# EAGLE design masterboard_b13 (EAGLE 8.2.1)
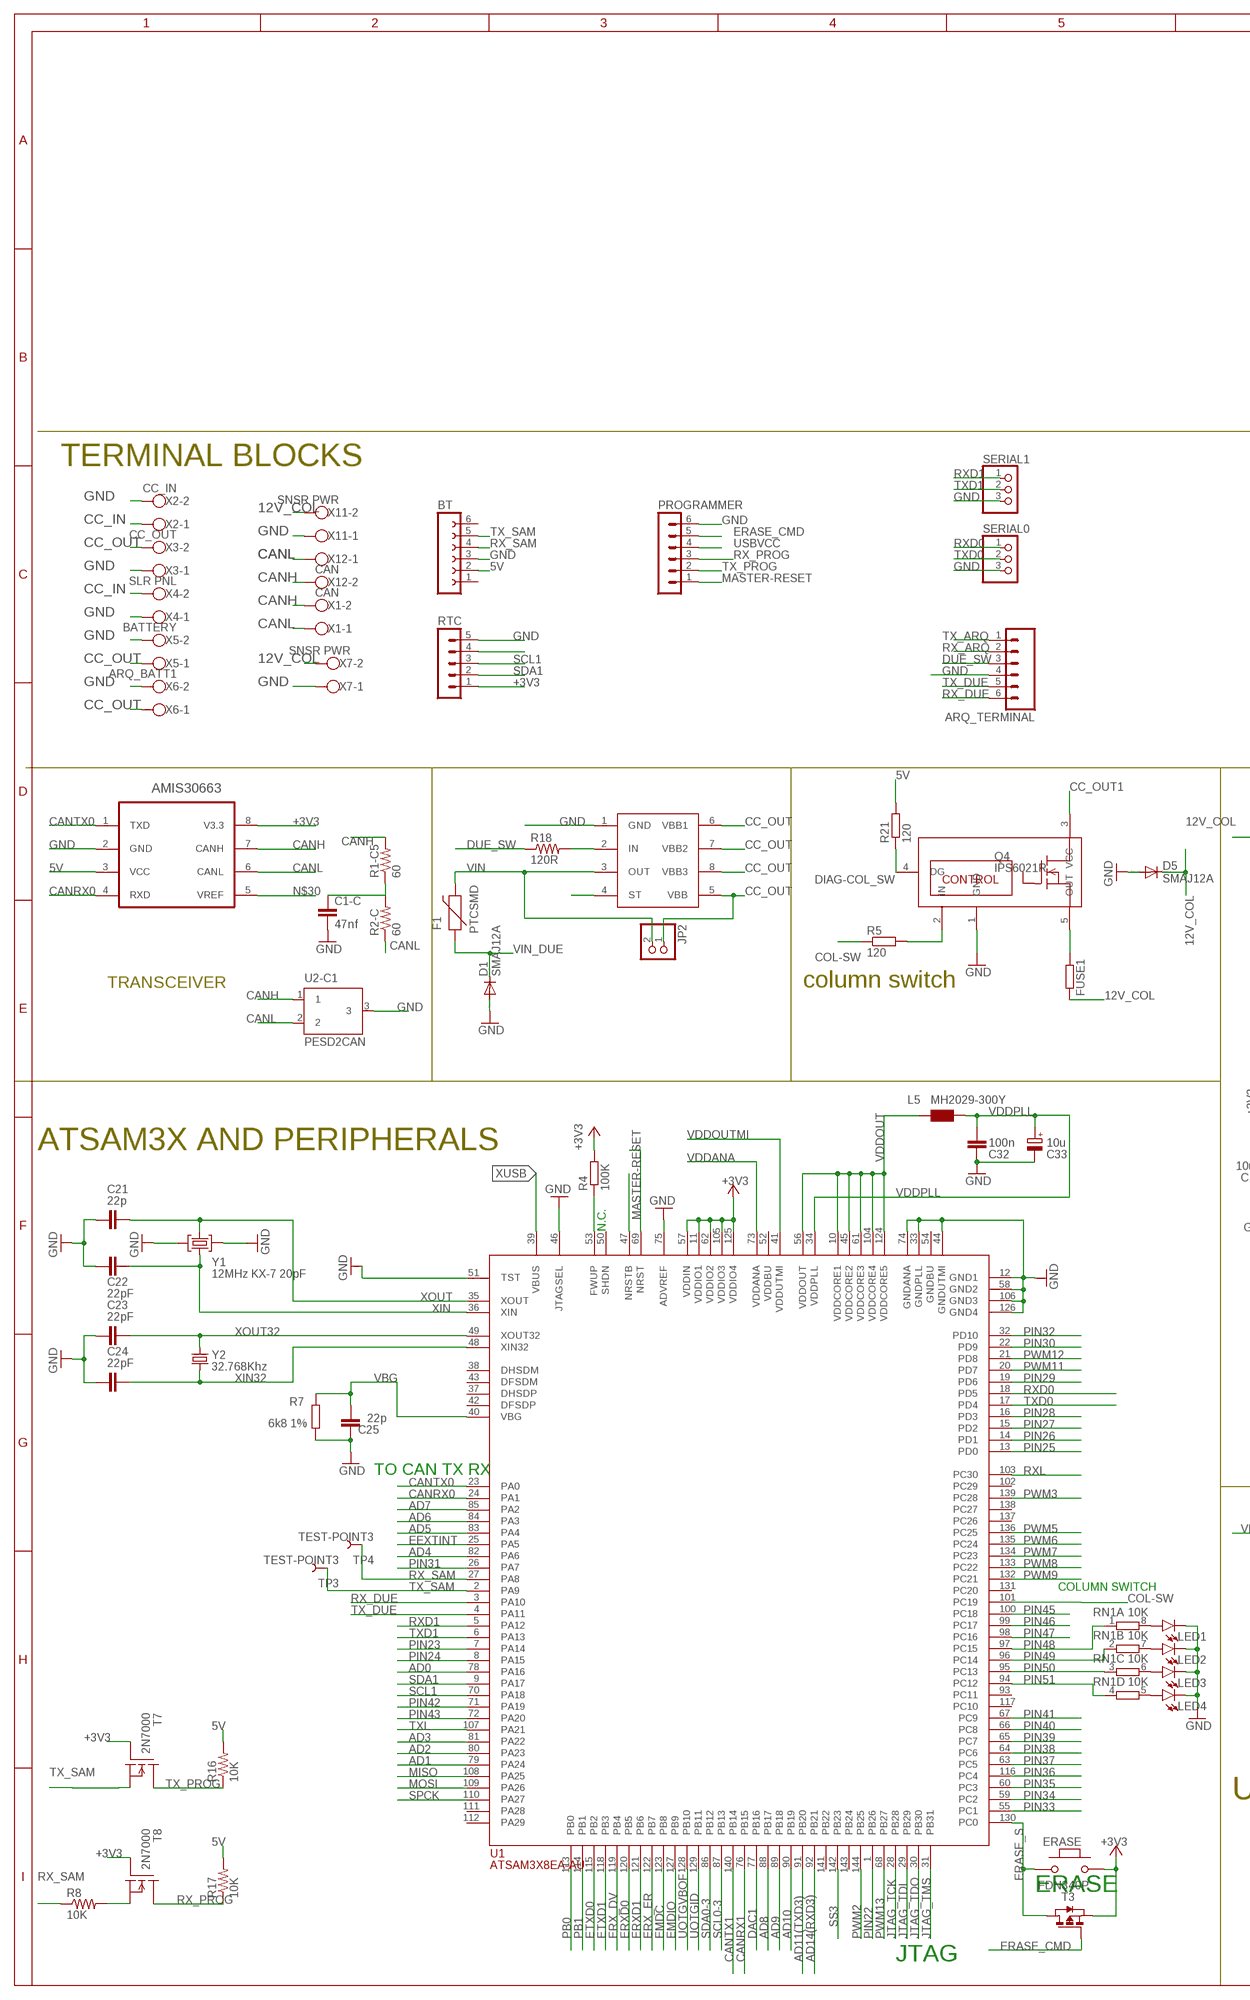
[diagram p0: schematic, sheet 1, part 1 of 2]
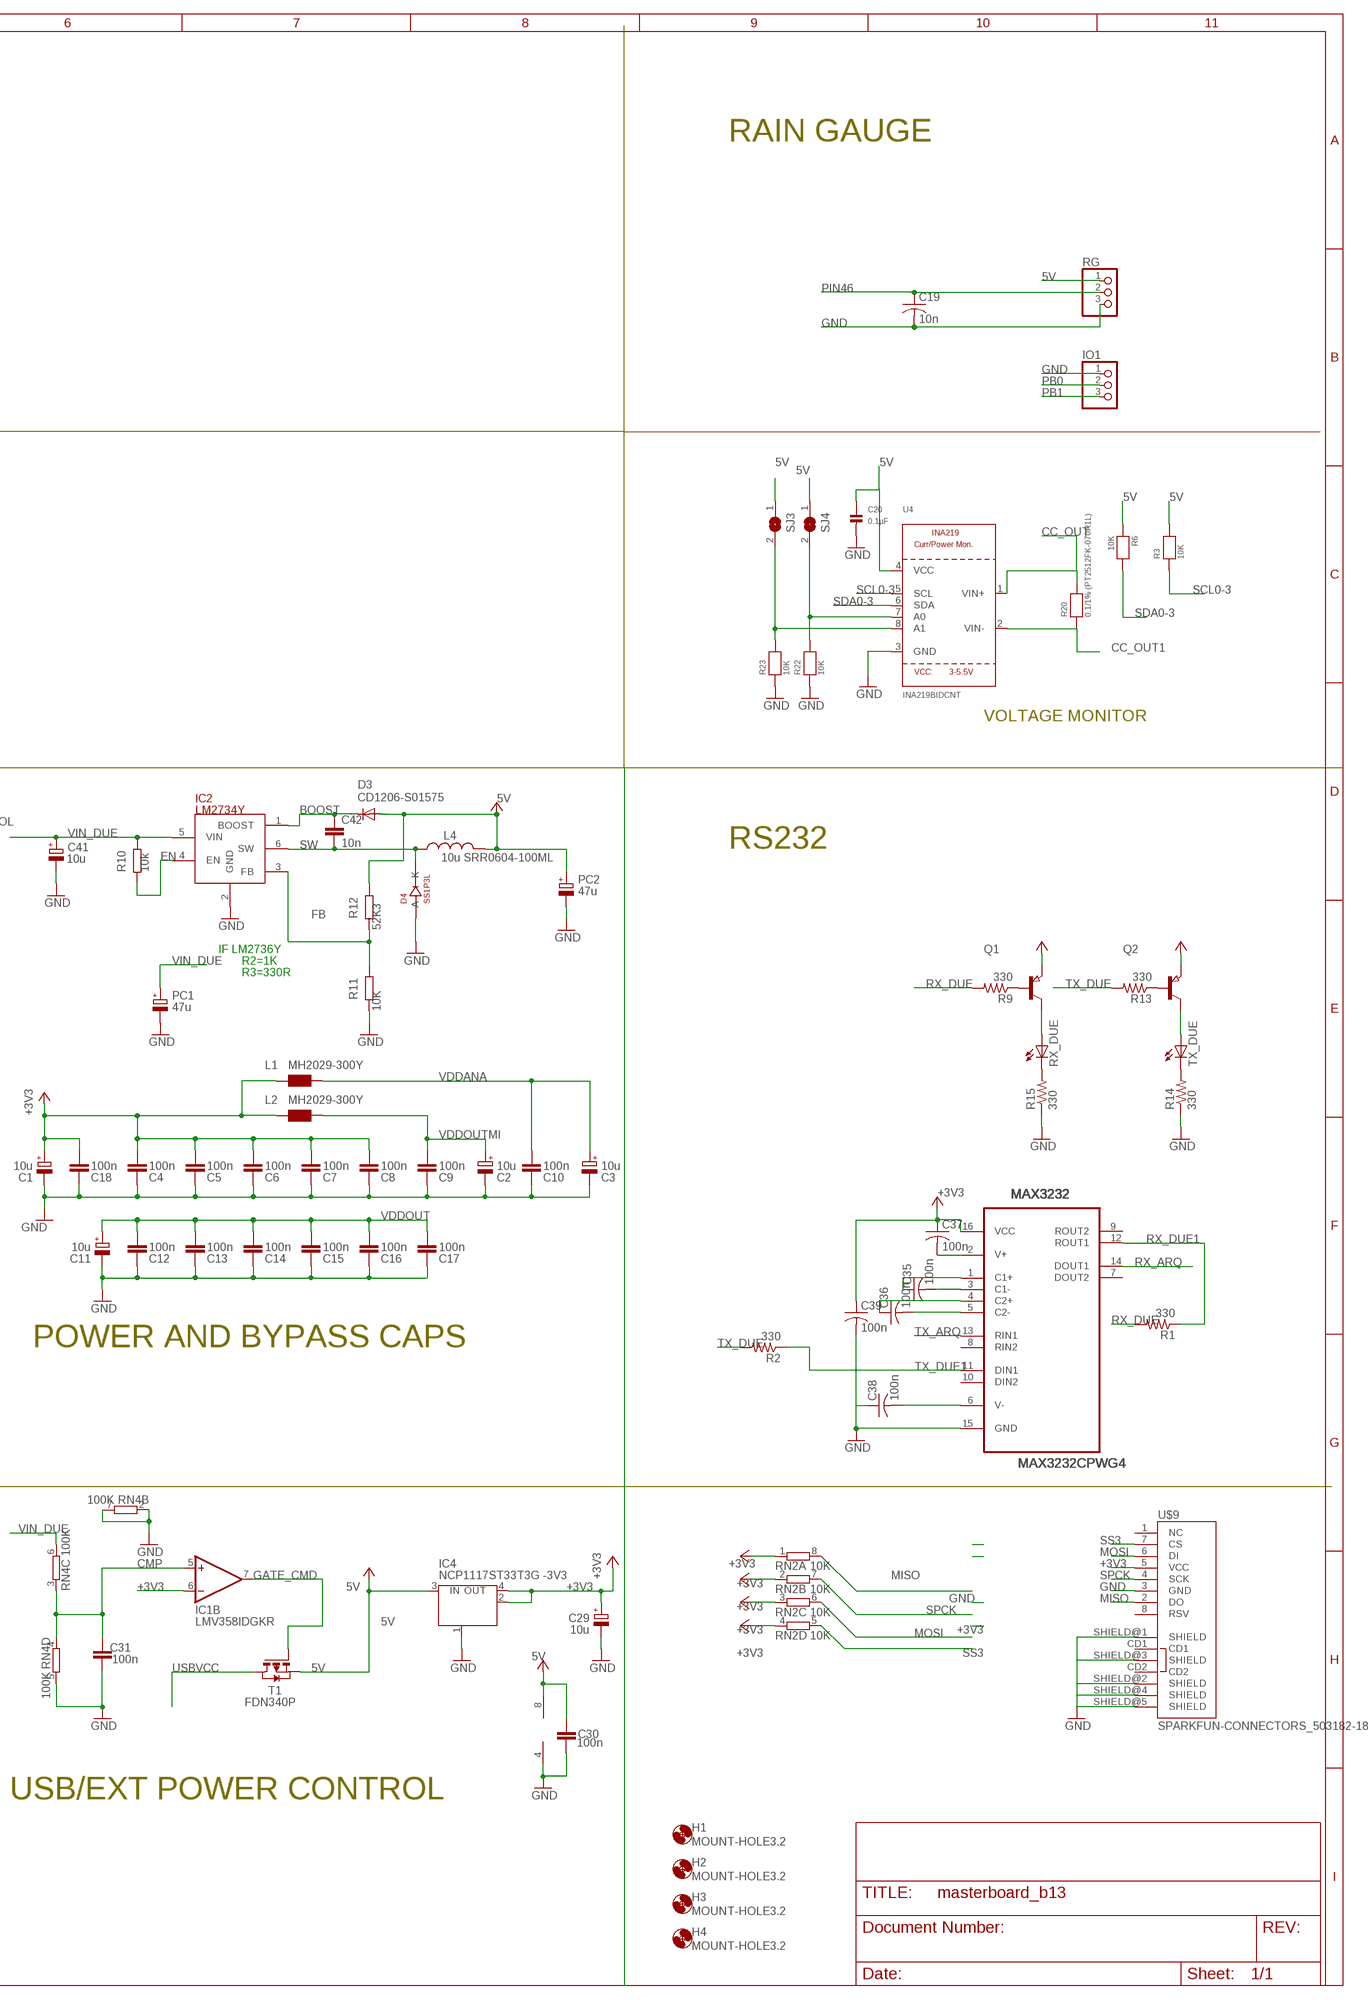
[diagram p1: schematic, sheet 1, part 2 of 2]

## Parts
ARQ_TERMINAL  M06POLAR  [MOLEX-1X6]
BT  FE06-1  [FE06]
C1  10u  CPOL-EUSMCB  [SMC_B]
C1-C  47nf  C-EUC0805  [C0805]
C2  10u  CPOL-EUSMCB  [SMC_B]
C3  10u  CPOL-EUSMCB  [SMC_B]
C4  100n  C-EUC0402  [C0402]
C5  100n  C-EUC0402  [C0402]
C6  100n  C-EUC0402  [C0402]
C7  100n  C-EUC0402  [C0402]
C8  100n  C-EUC0402  [C0402]
C9  100n  C-EUC0402  [C0402]
C10  100n  C-EUC0402  [C0402]
C11  10u  CPOL-EUSMCB  [SMC_B]
C12  100n  C-EUC0402  [C0402]
C13  100n  C-EUC0402  [C0402]
C14  100n  C-EUC0402  [C0402]
C15  100n  C-EUC0402  [C0402]
C16  100n  C-EUC0402  [C0402]
C17  100n  C-EUC0402  [C0402]
C18  100n  C-EUC0402  [C0402]
C19  10n  C-USC0603  [C0603]
C20  0.1µF  CAP_CERAMIC0603MINI  [0603-MINI]
C21  22p  C-EUC0402  [C0402]
C22  22pF  C-EUC0402  [C0402]
C23  22pF  C-EUC0402  [C0402]
C24  22pF  C-EUC0402  [C0402]
C25  22p  C-EUC0402  [C0402]
C29  10u  CPOL-EUSMCB  [SMC_B]
C30  100n  C-EUC0402  [C0402]
C31  100n  C-EUC0402  [C0402]
C32  100n  C-EUC0402  [C0402]
C33  10u  CPOL-EUSMCB  [SMC_B]
C35  100n  C-USC0603  [C0603]
C36  100n  C-USC0603  [C0603]
C37  100n  C-USC0603  [C0603]
C38  100n  C-USC0603  [C0603]
C39  100n  C-USC0603  [C0603]
C41  10u  CPOL-EUSMCB  [SMC_B]
C42  10n  C-EUC0603  [C0603-ROUND]
D1  SMAJ12A  DIODE-DO214AC  [DO214AC]
D3  CD1206-S01575  DIODE-MINIMELF  [MINIMELF]
D4  SS1P3L  [DO220AAL]
D5  SMAJ12A  DIODE-DO214AC  [DO214AC]
ERASE  MYSMD_PB157  [SMD_157SW]
F1  PTCSMD  [PTC-1206]
FUSE1  R-EU_1812X7R  [1812X7R]
H1  MOUNT-HOLE3.2  [3,2]
H2  MOUNT-HOLE3.2  [3,2]
H3  MOUNT-HOLE3.2  [3,2]
H4  MOUNT-HOLE3.2  [3,2]
IC1  LMV358IDGKR  LMV358MMX  [MSOP08]
IC2  LM2734Y  LM2736Y  [SOT23-6]
IC4  NCP1117ST33T3G -3V3  MC33269ST-3.3T3  [SOT223]
IO1  PINHD-1X3  [1X03]
JP2  PINHD-1X2  [1X02]
L1  MH2029-300Y  WE-CBF_0805  [0805]
L2  MH2029-300Y  WE-CBF_0805  [0805]
L4  10u SRR0604-100ML  L-USSRR0604  [SRR0604]
L5  MH2029-300Y  WE-CBF_0805  [0805]
LED1  LED0603  [LED-0603]
LED2  LED0603  [LED-0603]
LED3  LED0603  [LED-0603]
LED4  LED0603  [LED-0603]
MAX3232  MAX3232CPWG4  [SOP65P640X120-16N]
PC1  47u  CPOL-EUD  [PANASONIC_D]
PC2  47u  CPOL-EUD  [PANASONIC_D]
PROGRAMMER  MA06-1  [MA06-1]
Q1  PNP-TRANSISTOR_SOT23  [SOT23]
Q2  PNP-TRANSISTOR_SOT23  [SOT23]
Q4  IPS6021R  [DPAK-5LEAD]
R1  330  R-US_R0603  [R0603]
R1-C5  60  R-US_R2512  [R2512]
R2  330  R-US_R0603  [R0603]
R2-C  60  R-US_R2512  [R2512]
R3  10K  RESISTOR0603MINI  [0603-MINI]
R4  100K  R-EU_R0402  [R0402]
R5  120  R-EU_R0603  [R0603]
R6  10K  RESISTOR0603MINI  [0603-MINI]
R7  6k8 1%  R-EU_R0603  [R0603-ROUND]
R8  10K  R-US_R0603  [R0603]
R9  330  R-US_R0603  [R0603]
R10  10k  R-EU_R0402  [R0402]
R11  10K  R-EU_0603-RND  [R0603-ROUND]
R12  52K3  R-EU_0603-RND  [R0603-ROUND]
R13  330  R-US_R0603  [R0603]
R14  330  R-US_R0603  [R0603]
R15  330  R-US_R0603  [R0603]
R16  10K  R-US_R0603  [R0603]
R17  10K  R-US_R0603  [R0603]
R18  120R  R-US_R0603  [R0603]
R20  0.1/1% (PT2512FK-070R1L)  RESISTOR2512  [2512]
R21  120  R-EU_R0603  [R0603]
R22  10K  RESISTOR0603MINI  [0603-MINI]
R23  10K  RESISTOR0603MINI  [0603-MINI]
RG  PINHD-1X3  [1X03]
RN1  10K  4R-NCAT16  [CAT16]
RN2  10K  4R-NCAT16  [CAT16]
RN4  100K  4R-NCAT16  [CAT16]
RTC  MA05-1  [MA05-1]
RX_DUE  LEDCHIPLED_0603  [CHIPLED_0603]
SERIAL0  PINHD-1X3  [1X03]
SERIAL1  PINHD-1X3  [1X03]
SJ3  SOLDERJUMPERREFLOW_NOPASTE  [SOLDERJUMPER_REFLOW_NOPASTE]
SJ4  SOLDERJUMPERREFLOW_NOPASTE  [SOLDERJUMPER_REFLOW_NOPASTE]
T1  FDN340P  PMOSSOT23  [SOT-23]
T3  FDN340P  PMOSSOT23  [SOT-23]
T7  2N7000  [SOT23]
T8  2N7000  [SOT23]
TP3  TEST-POINT3  [PAD.03X.03]
TP4  TEST-POINT3  [PAD.03X.03]
TX_DUE  LEDCHIPLED_0603  [CHIPLED_0603]
U1  ATSAM3X8EA-AU  ATSAM3X/AAU  [LQFP144]
U2  INF-PG-DSO-8-24_L_1  [INF-PG-DSO-8-24_L_1PRIMARY]
U2-C  AMIS30663CAN  [SOIC8]
U2-C1  PESD2CAN  [SOT23]
U4  INA219BIDCNT  INA219  [SOT23-8]
U$9  SPARKFUN-CONNECTORS_503182-1853  [SPARKFUN-CONNECTORS_503182-1853]
X1  CAN  W237-102  [W237-102]
X2  CC_IN  W237-102  [W237-102]
X3  CC_OUT  W237-102  [W237-102]
X4  SLR PNL  W237-102  [W237-102]
X5  BATTERY  W237-102  [W237-102]
X6  ARQ_BATT1  W237-102  [W237-102]
X7  SNSR PWR  W237-102  [W237-102]
X11  SNSR PWR  W237-102  [W237-102]
X12  CAN  W237-102  [W237-102]
Y1  12MHz KX-7 20pF  CRYSTAL-3.2-2.5  [CRYSTAL-3.2-2.5]
Y2  32.768Khz  RESONATOR_EPSON_FC_145  [RESONATOR_EPSON_FC_145]

## Nets
5V: BT.2 C20.1 C30.2 D3.A IC1.8(P:V+) IC4.3(IN) L4.P$2 PC2.+ R3.2 R6.1 R12.1 R16.2 R17.2 R21.2 RG.1 SJ3.1 SJ4.1 T1.2(S) U2-C.3(VCC) U4.4(VCC) ; supply symbol labelled +5V
12V_COL: D5.C FUSE1.2 X7.2 X11.2
+3V3: C1.+ C4.2 C5.2 C6.2 C7.2 C8.2 C18.2 C29.+ C37.1 C39.1 ERASE.1 IC1.6(B:-IN) IC4.2(OUT) IC4.4(OUT) L1.1 L2.1 MAX3232.16(VCC) Q1.2(E) Q2.2(E) R4.2 RN2.1 RN2.2 RN2.3 RN2.4 RTC.1 T3.2(S) T7.1(G) T8.1(G) U1.11(VDDIO1) U1.57(VDDIN) U1.62(VDDIO2) U1.105(VDDIO3) U1.125(VDDIO4) U2-C.8(V3.3) U$9.5(VCC) ; supply symbol labelled VCC
AD0: U1.78(PA16)
AD1: U1.79(PA24)
AD2: U1.80(PA23)
AD3: U1.81(PA22)
AD4: U1.82(PA6)
AD5: U1.83(PA4)
AD6: U1.84(PA3)
AD7: U1.85(PA2)
AD8: U1.88(PB17)
AD9: U1.89(PB18)
AD10: U1.90(PB19)
AD11(TXD3): U1.91(PB20)
AD14(RXD3): U1.92(PB21)
BOOST: C42.1 D3.C IC2.1(BOOST)
CANH: R1-C5.2 U2-C1.1 U2-C.7(CANH) X1.2 X12.2
CANL: R2-C.1 U2-C1.2 U2-C.6(CANL) X1.1 X12.1
CANRX0: U1.24(PA1) U2-C.4(RXD)
CANRX1: U1.76(PB15)
CANTX0: U1.23(PA0) U2-C.1(TXD)
CANTX1: U1.140(PB14)
CC_IN: X2.1 X4.2
CC_OUT: JP2.1 R20.2 U2.5(VBB) U2.6(VBB1) U2.7(VBB2) U2.8(VBB3) U4.1(VIN+) X3.2 X5.1 X6.1
CC_OUT1: Q4.3(VCC) R20.1 U4.2(VIN-)
CMP: C31.2 IC1.5(B:+IN) RN4.3 RN4.4
COL-SW: R5.1 U1.101(PC19)
DAC1: U1.77(PB16)
DIAG-COL_SW: Q4.4(DG) R21.1
DUE_SW: ARQ_TERMINAL.3 R18.1
EEXTINT: U1.25(PA5)
EMDC: U1.123(PB8)
EMDIO: U1.127(PB9)
EN: IC2.4(EN) R10.2
ERASE_CMD: PROGRAMMER.5 T3.3(G)
ERASE_S: ERASE.2 T3.1(D) U1.130(PC0)
ERX_DV: U1.119(PB4)
ERX_ER: U1.122(PB7)
ERXD0: U1.120(PB5)
ERXD1: U1.121(PB6)
ETXD0: U1.115(PB2)
ETXD1: U1.118(PB3)
FB: IC2.3(FB) R11.1 R12.2
GATE_CMD: IC1.7(B:OUT) T1.3(G)
GND: ARQ_TERMINAL.4 BT.3 C1-C.2 C1.- C2.- C3.- C4.1 C5.1 C6.1 C7.1 C8.1 C9.1 C10.1 C11.- C12.1 C13.1 C14.1 C15.1 C16.1 C17.1 C18.1 C19.2 C20.2 C21.2 C22.2 C23.2 C24.2 C25.2 C29.- C30.1 C31.1 C32.1 C33.- C38.1 C39.2 C41.- D1.A D4.P$2(A) D5.A IC1.4(P:V-) IC2.2(GND) IC4.1(GND/ADJ) IO1.1 LED1.C LED2.C LED3.C LED4.C MAX3232.15(GND) PC1.- PC2.- PROGRAMMER.6 Q4.1(GND) R7.1 R11.2 R14.1 R15.1 R22.1 R23.1 RG.3 RN4.2 RN4.5 RN4.7 RTC.5 SERIAL0.3 SERIAL1.3 U1.12(GND1) U1.33(GNDPLL) U1.44(GNDUTMI) U1.46(JTAGSEL) U1.51(TST) U1.58(GND2) U1.74(GNDANA) U1.75(ADVREF) U1.106(GND3) U1.126(GND4) U2-C1.3 U2-C.2(GND) U2.1(GND) U4.3(GND) U$9.3(GND) U$9.SHIELD@1(SHIELD) U$9.SHIELD@2(SHIELD) U$9.SHIELD@3(SHIELD) U$9.SHIELD@4(SHIELD) U$9.SHIELD@5(SHIELD) X2.2 X3.1 X4.1 X5.2 X6.2 X7.1 X11.1 Y1.2(GND) Y1.4(GND)
JTAG_TCK: U1.28(PB28)
JTAG_TDI: U1.29(PB29)
JTAG_TDO: U1.30(PB30)
JTAG_TMS: U1.31(PB31)
MASTER-RESET: PROGRAMMER.1 U1.69(NRST)
MISO: RN2.8 U1.108(PA25) U$9.2(DO)
MOSI: RN2.6 U1.109(PA26) U$9.6(DI)
N$3: Q2.3(C) TX_DUE.A
N$4: FUSE1.1 Q4.5(OUT)
N$6: LED3.A RN1.6
N$7: R4.1 U1.53(FWUP)
N$8: Q1.1(B) R9.1
N$9: Q1.3(C) RX_DUE.A
N$10: R14.2 TX_DUE.C
N$11: Q4.2(IN) R5.2
N$12: R8.2 T8.2(S)
N$13: C35.1 MAX3232.1(C1+)
N$14: C35.2 MAX3232.3(C1-)
N$15: C36.1 MAX3232.4(C2+)
N$16: C36.2 MAX3232.5(C2-)
N$17: R15.2 RX_DUE.C
N$18: Q2.1(B) R13.1
N$19: C38.2 MAX3232.6(V-)
N$21: LED4.A RN1.5
N$22: C37.2 MAX3232.2(V+)
N$23: R18.2 U2.2(IN)
N$24: LED2.A RN1.7
N$25: U2.4(ST)
N$26: LED1.A RN1.8
N$27: RTC.4
N$28: C1-C.1 R1-C5.1 R2-C.2
N$30: U2-C.5(VREF)
N$32: R22.2 SJ4.2 U4.7(A0)
N$33: R23.2 SJ3.2 U4.8(A1)
NRSTB: U1.47(NRSTB)
PB0: IO1.2 U1.113(PB0)
PB1: IO1.3 U1.114(PB1)
PIN22: U1.1(PB26)
PIN23: U1.7(PA14)
PIN24: U1.8(PA15)
PIN25: U1.13(PD0)
PIN26: U1.14(PD1)
PIN27: U1.15(PD2)
PIN28: U1.16(PD3)
PIN29: U1.19(PD6)
PIN30: U1.22(PD9)
PIN31: U1.26(PA7)
PIN32: U1.32(PD10)
PIN33: U1.55(PC1)
PIN34: U1.59(PC2)
PIN35: U1.60(PC3)
PIN36: U1.116(PC4)
PIN37: U1.63(PC5)
PIN38: U1.64(PC6)
PIN39: U1.65(PC7)
PIN40: U1.66(PC8)
PIN41: U1.67(PC9)
PIN42: U1.71(PA19)
PIN43: U1.72(PA20)
PIN45: U1.100(PC18)
PIN46: C19.1 RG.2 U1.99(PC17)
PIN47: U1.98(PC16)
PIN48: RN1.1 U1.97(PC15)
PIN49: RN1.2 U1.96(PC14)
PIN50: RN1.3 U1.95(PC13)
PIN51: RN1.4 U1.94(PC12)
PWM2: U1.144(PB25)
PWM3: U1.139(PC28)
PWM5: U1.136(PC25)
PWM6: U1.135(PC24)
PWM7: U1.134(PC23)
PWM8: U1.133(PC22)
PWM9: U1.132(PC21)
PWM11: U1.20(PD7)
PWM12: U1.21(PD8)
PWM13: U1.68(PB27)
RX_ARQ: ARQ_TERMINAL.2 MAX3232.14(DOUT1)
RX_DUE: ARQ_TERMINAL.6 R1.2 R9.2 U1.3(PA10)
RX_DUE1: MAX3232.12(ROUT1) R1.1
RX_PROG: PROGRAMMER.3 R17.1 T8.3(D)
RX_SAM: BT.4 R8.1 TP4.P$1 U1.27(PA8)
RXD0: SERIAL0.1 U1.18(PD5)
RXD1: SERIAL1.1 U1.5(PA12)
RXL: U1.103(PC30)
SCL0-3: R3.1 U1.87(PB13) U4.5(SCL)
SCL1: RTC.3 U1.70(PA18)
SDA0-3: R6.2 U1.86(PB12) U4.6(SDA)
SDA1: RTC.2 U1.9(PA17)
SPCK: RN2.7 U1.110(PA27) U$9.4(SCK)
SS3: RN2.5 U1.142(PB23) U$9.7(CS)
SW: C42.2 D4.P$1(K) IC2.6(SW) L4.P$1
TX_ARQ: ARQ_TERMINAL.1 MAX3232.13(RIN1)
TX_DUE: ARQ_TERMINAL.5 R2.2 R13.2 U1.4(PA11)
TX_DUE1: MAX3232.11(DIN1) R2.1
TX_PROG: PROGRAMMER.2 R16.1 T7.3(D)
TX_SAM: BT.5 T7.2(S) TP3.P$1 U1.2(PA9)
TXD0: SERIAL0.2 U1.17(PD4)
TXD1: SERIAL1.2 U1.6(PA13)
TXL: U1.107(PA21)
UOTGID: U1.129(PB11)
UOTGVBOF: U1.128(PB10)
USBVCC: PROGRAMMER.4 T1.1(D)
VBG: C25.1 R7.2 U1.40(VBG)
VDDANA: C3.+ C10.2 L1.2 U1.73(VDDANA)
VDDOUT: C11.+ C12.2 C13.2 C14.2 C15.2 C16.2 C17.2 L5.1 U1.10(VDDCORE1) U1.45(VDDCORE2) U1.56(VDDOUT) U1.61(VDDCORE3) U1.104(VDDCORE4) U1.124(VDDCORE5)
VDDOUTMI: C2.+ C9.2 L2.2 U1.41(VDDUTMI)
VDDPLL: C32.2 C33.+ L5.2 U1.34(VDDPLL)
VIN: F1.2 JP2.2 U2.3(OUT)
VIN_DUE: C41.+ D1.C F1.1 IC2.5(VIN) PC1.+ R10.1 RN4.6
XIN: C22.1 U1.36(XIN) Y1.1(C1)
XIN32: C24.1 U1.48(XIN32) Y2.P$2
XOUT: C21.1 U1.35(XOUT) Y1.3(C2)
XOUT32: C23.1 U1.49(XOUT32) Y2.P$1
XUSB [usbvcc]: U1.39(VBUS)
Unconnected: BT.1 BT.6 IC1.1(A:OUT) IC1.2(A:-IN) IC1.3(A:+IN) MAX3232.7(DOUT2) MAX3232.8(RIN2) MAX3232.9(ROUT2) MAX3232.10(DIN2) RN4.1 RN4.8 U1.37(DHSDP) U1.38(DHSDM) U1.42(DFSDP) U1.43(DFSDM) U1.50(SHDN) U1.93(PC11) U1.102(PC29) U1.111(PA28) U1.112(PA29) U1.117(PC10) U1.131(PC20) U1.137(PC26) U1.138(PC27) U1.141(PB22) U1.143(PB24) U$9.1(NC) U$9.8(RSV) U$9.CD1 U$9.CD2

## Notes on the sheet
- RAIN GAUGE
- TERMINAL BLOCKS
- VOLTAGE MONITOR
- RS232
- IF LM2736Y
- R2=1K
- R3=330R
- TRANSCEIVER | column switch
- ATSAM3X AND PERIPHERALS
- N.C.
- POWER AND BYPASS CAPS
- TO CAN TX RX
- COLUMN SWITCH
- USB/EXT POWER CONTROL
- ERASE
- JTAG

## Power pins joined to a net without a drawn wire
GNDBU: U1.54(GNDBU)
VDDBU: U1.52(VDDBU)

## Library data of the parts
ARQ_TERMINAL = SparkFun-Connectors:M06: Header 6 Standard 6-pin 0.1" header. Use with straight break away headers (SKU : PRT-00116), right angle break away headers (PRT-00553), swiss pins (PRT-00743), machine pins (PRT-00117), and female headers (PRT-00115). Molex polarized connector foot print use with SKU : PRT-08094 with associated crimp pins and housings. NOTES ON THE VARIANTS LOCK and LOCK_LONGPADS... This footprint was designed to help hold the alignment of a through-hole component (i.e. 6-pin header) while soldering it into place. You may notice that each hole has been shifted either up or down by 0.005 of an inch from it's more standard position (which is a perfectly straight line). This slight alteration caused the pins (the squares in the middle) to touch the edges of the holes. Because they are alternating, it causes a "brace" to hold the component in place. 0.005 has proven to be the perfect amount of "off-center" position when using our standard breakaway headers. Although looks a little odd when you look at the bare footprint, once you have a header in there, the alteration is very hard to notice. Also,if you push a header all the way into place, it is covered up entirely on the bottom side. This idea of altering the position of holes to aid alignment will be further integrated into the Sparkfun Library for other footprints. It can help hold any component with 3 or more connection pins.
BT = con-lsta:FE06-1: FEMALE HEADER; OC_FARNELL: unknown; OC_NEWARK: unknown
C1-C3 C11 C29 C33 C41 PC1 PC2 = rcl:CPOL-EU: POLARIZED CAPACITOR, European symbol
C1-C = rcl:C-EU: CAPACITOR, European symbol
C4-C10 C12-C18 C21-C25 C30-C32 C42 = SmartPrj:C-EU: CAPACITOR, European symbol
C19 C35-C39 = rcl:C-US: CAPACITOR, American symbol
C20 = microbuilder:CAP_CERAMIC: Ceramic Capacitors 0402 - 0402 Surface Mount Capacitors 16pF 50V 5% [Digikey: 445-4899-2-ND] 18pF 50V 5% [Digikey: 490-1281-2-ND] 22pF 50V 5% [Digikey: 490-1283-2-ND] 68pF 50V 5% [Digikey: 490-1289-2-ND] 0.1uF 10V 10% [Digikey: 490-1318-2-ND] 1.0uF 6.3V 10% [Digikey: 490-1320-2-ND] 0603 - 0603 Surface Mount Capacitors 16 pF 50V 5% [Digikey: 445-5051-2-ND] 22 pF 50V [Digikey: PCC220ACVTR-ND] 33 pF 50V 5% [Digikey: 490-1415-1-ND] 56pF 50V 5% [Digikey: 490-1421-1-ND] 220pF 50V 5% [Digikey: 445-1285-1-ND] 680 pF 50V 2200 pF 50V 5% C0G [Digikey: 445-1297-1-ND] 5600 pF 100V 5% X7R [Digikey: 478-3711-1-ND] 0.1 µF 25V 10% [Digikey: PCC2277TR-ND] 0.22 µF 16V 10% X7R [Digikey: 445-1318-1-ND] 1.0 µF 25V 10% [Digikey: 445-5146-2-ND] 0603 - RF Specific 3pF 250V +/-0.1pF RF [Digikey: 712-1347-1-ND] 18 pF 250V 5% [Digikey: 478-3505-1-ND or 712-1322-1-ND] 56 pF 250V 5% C0G RF [Digikey: 490-4867-1-ND] 68 pF 250V RF [Digikey: 490-4868-1-ND] 0805 - 0805 Surface Mount Capacitors 220 pF 250V 2% RF Ceramic Capacitor [Digikey: 712-1398-1-ND] 1000 pF 50V 2% NP0 Ceramic Capacitor [Digikey: 478-3760-1-ND] 0.1 µF 25V 10% Ceramic Capacitor [Digikey: PCC1828TR-ND] 1.0 µF 16V 10% Ceramic Capacitor[Digikey: 490-1691-2-ND] 10.0 µF 10V 10% Ceramic Capacitor[Digikey: 709-1228-1-ND] 10.0 uF 16V 10% Ceramic Capacitor [Digikey: 478-5165-2-ND] 47 uF 6.3V 20% Ceramic Capacitor [Digikey: 587-1779-1-ND or 399-5506-1-ND] 1206 - 1206 Surface Mount Capacitors 47uF 10V 20% Ceramic Capacitor [Digikey: 490-5528-1-ND or 399-5508-1-ND or 445-6010-1-ND] 100uF 6.3V -20%, +80% Y5V Ceramic Capacitor (Digikey: 490-4512-1-ND, Mouser: 81-GRM31CF50J107ZE1L); MPN: 04023C104KAT2A; OC_NEWARK: 37T9047
D1 D3 D5 = diode:DIODE-: DIODE
D4 = SmartPrj:SS1P3L
ERASE = SmartPrj:MYSMD_PB157
F1 = SparkFun-PowerIC:PTC: Resettable Fuse PTC Resettable Fuse. Spark Fun Electronics SKU : COM-08357; PROD_ID: RES-11150
FUSE1 R5 R21 = rcl:R-EU_: RESISTOR, European symbol
H1-H4 = holes:MOUNT-HOLE: MOUNTING HOLE with drill center marker
IC1 = linear:LMV358?*: Dual General Purpose, Low Voltage, Rail-to-Rail Output Operational Amplifiers Source: http://www.national.com/mpf/LM/LMV321.html http://www.national.com/dt/lmv_qual.pdf
IC2 = SmartPrj:LM2736Y
IC4 = linear:MC33269ST*: Adjustable Output Low Dropout Voltage Regulator 800 mA Source: http://www.onsemi.com/pub/Collateral/MC33269-D.PDF
IO1 RG SERIAL0 SERIAL1 = adafruit:PINHD-1X3: PIN HEADER
JP2 = pinhead:PINHD-1X2: PIN HEADER
L1 L2 L5 = wuerth-elektronik:WE-CBF: SMD EMI Suppression Ferrite Beads - excellent anti-EMI properties - low DCR - impedances till 3000 ohms - rated current up to 6 A
L4 = SmartPrj:L-US: INDUCTOR, American symbol
LED1-LED4 = SparkFun-LED:LED: LEDs Standard schematic elements and footprints for 5mm, 3mm, 1206, and 0603 sized LEDs. 5mm - Spark Fun Electronics SKU : COM-00529 (and others)
MAX3232 = max3232CPWG4:MAX3232CPWG4: Multichannel RS232 line driver; MPN: MAX3232CPWG4; OC_FARNELL: 1287432; OC_NEWARK: 26M0605; PACKAGE: TSSOP-16; SUPPLIER: Texas Instruments
PROGRAMMER = con-lstb:MA06-1: PIN HEADER; OC_FARNELL: unknown; OC_NEWARK: unknown
Q1 Q2 = semicon-smd-ipc:PNP-TRANSISTOR_: PNP TRANSISTOR
Q4 = DRiMS-Dong:IPS6021
R1 R2 R9 R13-R15 = adafruit:R-US_: RESISTOR, American symbol
R1-C5 R2-C R8 R16-R18 = rcl:R-US_: RESISTOR, American symbol
R3 R6 R22 R23 = microbuilder:RESISTOR: Resistors 0402 - 0402 Surface Mount Package 22 Ohm 1% 1/16W [Digikey: 311-22.0LRTR-ND] 33 Ohm 5% 1/16W 1.0K 5% 1/16W 1.5K 5% 1/16W 2.0K 1% 1/16W 10.0K 1% 1/16W [Digikey: 311-10.0KLRTR-ND] 10.0K 5% 1/16W [Digikey: RMCF0402JT10K0TR-ND] 12.1K 1% 1/16W [Digikey: 311-22.0LRTR-ND] 100.0K 5% 1/16W 0603 - 0603 Surface Mount Package 0 Ohm 1/10 Watt 1% Resistor 15 Ohm 1/10 Watt 1% Resistor 33 Ohm 1/10 Watt 1% Resistor 49.9 Ohm 1/10 Watt 1% Resistor 100 Ohm 1/10 Watt 1% Resistor 150 Ohm 1/10 Watt 1% Resistor 240 Ohm 1/10 Watt 1% Resistor 390 Ohm 1/10 Watt 1% Resistor 560 Ohm 1/10 Watt 1% Resistor 680 Ohm 1/10 Watt 1% Resistor 750 Ohm 1/10 Watt 1% Resistor 1.0K Ohm 1/10 Watt 1% Resistor 1.5K Ohm 1/10 Watt 1% Resistor 2.0K Ohm 1/10 Watt 1% Resistor 2.2K Ohm 1/10 Watt 1% Resistor 3.3K Ohm 1/10 Watt 1% Resistor 4.7K Ohm 1/10 Watt 1% Resistor 10.0K Ohm 1/10 Watt 1% Resistor 12.0K Ohm 1/10 Watt 1% Resistor 12.1K Ohm 1/10 Watt 1% Resistor 20.0K Ohm 1/10 Watt 1% Resistor 33.0K Ohm 1/10 Watt 1% Resistor 100.0K Ohm 1/10 Watt 1% Resistor 0805 - 0805 Surface Mount Package 0 Ohm 1/8 Watt 1% Resistor 33 Ohm 1/8 Watt 1% Resistor 100 Ohm 1/8 Watt 1% Resistor 150 Ohm 1/8 Watt 1% Resistor 200 Ohm 1/8 Watt 1% Resistor 240 Ohm 1/8 Watt 1% Resistor 330 Ohm 1/8 Watt 1% Resistor 390 Ohm 1/8 Watt 1% Resistor 470 Ohm 1/8 Watt 1% Resistor 1.0K Ohm 1/8 Watt 1% Resistor 1.5K Ohm 1/8 Watt 1% Resistor 2.0K Ohm 1/8 Watt 1% Resistor 4.7K Ohm 1/8 Watt 1% Resistor 5.1K Ohm 1/8 Watt 1% Resistor 5.6K Ohm 1/8 Watt 1% Resistor 10.0K Ohm 1/8 Watt 1% Resistor 22.0K Ohm 1/8 Watt 1% Resistor 33.0K Ohm 1/8 Watt 1% Resistor 100K Ohm 1/8 Watt 1% Resistor 1206 - 1206 Surface Mount Package 2012 - 2010 Surface Mount Package 0.11 Ohm 1/2 Watt 1% Resistor - Digikey: RHM.11UCT-ND; MPN: TNPW040210K0BEED; OC_NEWARK: 11R2753
R4 R7 R10-R12 = SmartPrj:R-EU_: RESISTOR, European symbol
R20 = microbuilder:RESISTOR: Resistors 0402 - 0402 Surface Mount Package 22 Ohm 1% 1/16W [Digikey: 311-22.0LRTR-ND] 33 Ohm 5% 1/16W 1.0K 5% 1/16W 1.5K 5% 1/16W 2.0K 1% 1/16W 10.0K 1% 1/16W [Digikey: 311-10.0KLRTR-ND] 10.0K 5% 1/16W [Digikey: RMCF0402JT10K0TR-ND] 12.1K 1% 1/16W [Digikey: 311-22.0LRTR-ND] 100.0K 5% 1/16W 0603 - 0603 Surface Mount Package 0 Ohm 1/10 Watt 1% Resistor 15 Ohm 1/10 Watt 1% Resistor 33 Ohm 1/10 Watt 1% Resistor 49.9 Ohm 1/10 Watt 1% Resistor 100 Ohm 1/10 Watt 1% Resistor 150 Ohm 1/10 Watt 1% Resistor 240 Ohm 1/10 Watt 1% Resistor 390 Ohm 1/10 Watt 1% Resistor 560 Ohm 1/10 Watt 1% Resistor 680 Ohm 1/10 Watt 1% Resistor 750 Ohm 1/10 Watt 1% Resistor 1.0K Ohm 1/10 Watt 1% Resistor 1.5K Ohm 1/10 Watt 1% Resistor 2.0K Ohm 1/10 Watt 1% Resistor 2.2K Ohm 1/10 Watt 1% Resistor 3.3K Ohm 1/10 Watt 1% Resistor 4.7K Ohm 1/10 Watt 1% Resistor 10.0K Ohm 1/10 Watt 1% Resistor 12.0K Ohm 1/10 Watt 1% Resistor 12.1K Ohm 1/10 Watt 1% Resistor 20.0K Ohm 1/10 Watt 1% Resistor 33.0K Ohm 1/10 Watt 1% Resistor 100.0K Ohm 1/10 Watt 1% Resistor 0805 - 0805 Surface Mount Package 0 Ohm 1/8 Watt 1% Resistor 33 Ohm 1/8 Watt 1% Resistor 100 Ohm 1/8 Watt 1% Resistor 150 Ohm 1/8 Watt 1% Resistor 200 Ohm 1/8 Watt 1% Resistor 240 Ohm 1/8 Watt 1% Resistor 330 Ohm 1/8 Watt 1% Resistor 390 Ohm 1/8 Watt 1% Resistor 470 Ohm 1/8 Watt 1% Resistor 1.0K Ohm 1/8 Watt 1% Resistor 1.5K Ohm 1/8 Watt 1% Resistor 2.0K Ohm 1/8 Watt 1% Resistor 4.7K Ohm 1/8 Watt 1% Resistor 5.1K Ohm 1/8 Watt 1% Resistor 5.6K Ohm 1/8 Watt 1% Resistor 10.0K Ohm 1/8 Watt 1% Resistor 22.0K Ohm 1/8 Watt 1% Resistor 33.0K Ohm 1/8 Watt 1% Resistor 100K Ohm 1/8 Watt 1% Resistor 1206 - 1206 Surface Mount Package 2012 - 2010 Surface Mount Package 0.11 Ohm 1/2 Watt 1% Resistor - Digikey: RHM.11UCT-ND; OC_NEWARK: unknown
RN1 RN2 RN4 = resistor-dil:4R-N: Array Chip Resistor Source: RS Component / Phycomp; OC_FARNELL: unknown; OC_NEWARK: unknown
RTC = con-lstb:MA05-1: PIN HEADER; OC_FARNELL: unknown; OC_NEWARK: unknown
RX_DUE TX_DUE = led:LED: LED OSRAM: - CHIPLED LG R971, LG N971, LY N971, LG Q971, LY Q971, LO R971, LY R971 LH N974, LH R974 LS Q976, LO Q976, LY Q976 LO Q996 - Hyper CHIPLED LW Q18S LB Q993, LB Q99A, LB R99A - SideLED LS A670, LO A670, LY A670, LG A670, LP A670 LB A673, LV A673, LT A673, LW A673 LH A674 LY A675 LS A676, LA A676, LO A676, LY A676, LW A676 LS A679, LY A679, LG A679 - Hyper Micro SIDELED® LS Y876, LA Y876, LO Y876, LY Y876 LT Y87S - SmartLED LW L88C, LW L88S LB L89C, LB L89S, LG L890 LS L89K, LO L89K, LY L89K LS L896, LA L896, LO L896, LY L896 - TOPLED LS T670, LO T670, LY T670, LG T670, LP T670 LSG T670, LSP T670, LSY T670, LOP T670, LYG T670 LG T671, LOG T671, LSG T671 LB T673, LV T673, LT T673, LW T673 LH T674 LS T676, LA T676, LO T676, LY T676, LB T676, LH T676, LSB T676, LW T676 LB T67C, LV T67C, LT T67C, LS T67K, LO T67K, LY T67K, LW E67C LS E67B, LA E67B, LO E67B, LY E67B, LB E67C, LV E67C, LT E67C LW T67C LS T679, LY T679, LG T679 LS T770, LO T770, LY T770, LG T770, LP T770 LB T773, LV T773, LT T773, LW T773 LH T774 LS E675, LA E675, LY E675, LS T675 LS T776, LA T776, LO T776, LY T776, LB T776 LHGB T686 LT T68C, LB T68C - Hyper Mini TOPLED® LB M676 - Mini TOPLED Santana® LG M470 LS M47K, LO M47K, LY M47K Source: http://www.osram.convergy.de LUXEON: - LUMILED® LXK2-PW12-R00, LXK2-PW12-S00, LXK2-PW14-U00, LXK2-PW14-V00 LXK2-PM12-R00, LXK2-PM12-S00, LXK2-PM14-U00 LXK2-PE12-Q00, LXK2-PE12-R00, LXK2-PE12-S00, LXK2-PE14-T00, LXK2-PE14-U00 LXK2-PB12-K00, LXK2-PB12-L00, LXK2-PB12-M00, LXK2-PB14-N00, LXK2-PB14-P00, LXK2-PB14-Q00 LXK2-PR12-L00, LXK2-PR12-M00, LXK2-PR14-Q00, LXK2-PR14-R00 LXK2-PD12-Q00, LXK2-PD12-R00, LXK2-PD12-S00 LXK2-PH12-R00, LXK2-PH12-S00 LXK2-PL12-P00, LXK2-PL12-Q00, LXK2-PL12-R00 Source: www.luxeon.com KINGBRIGHT: KA-3528ASYC Source: www.kingbright.com
SJ3 SJ4 = microbuilder:SOLDERJUMPER: SMD Solder JUMPER Solder the two pads together to create a connection, or remove the solder to break it. REFLOW - Use this footprint for solder paste and reflow ovens. WAVE - Use this footprint for hand-soldering (larger pads). CLOSED - Has a trace between the two pads to ensure it is closed by default. The trace needs to be cut to disable the jumper, and can be closed again by creating a solder bridge between the two pads.; OC_NEWARK: unknown
T1 T3 = zetex:PMOSSOT23: MOS FET; OC_FARNELL: unknown; OC_NEWARK: unknown
T7 T8 = DRiMS-Dong:2N7000
TP3 TP4 = SparkFun-Passives:TEST-POINT: Bare copper test points for troubleshooting or ICT
U1 = SmartPrj:ATSAM3X/A
U2 = INF-PG-DSO-8-24_L:INF-PG-DSO-8-24_L_1
U2-C = khr_lib4:AMIS30663CAN: https://www.onsemi.com/pub/Collateral/AMIS-30663-D.PDF; MPN: AMIS30663; OC_FARNELL: -; OC_NEWARK: 75C7726; PACKAGE: SOIC-8; SUPPLIER: On Semiconductor
U2-C1 = PESD2CAN:PESD2CAN
U4 = microbuilder:INA219: INA219 - I2C Current/Power Monitor Voltage Range: 0-26V Accuracy: 0.5% Temperature: -40°C - 125°C; MPN: INA219BIDCNT; OC_NEWARK: 28X4259
U$9 = masterboard_b12:SPARKFUN-CONNECTORS_503182-1853
X1-X7 X11 X12 = con-wago-500:W237-102: WAGO SCREW CLAMP; MPN: 237-102; OC_FARNELL: unknown; OC_NEWARK: 70K9898
Y1 = SmartPrj:CRYSTAL-3.2-2.5
Y2 = Arduino_Wifi_shield_v018_tG:RESONATOR_EPSON_FC_145

## Net classes
1 USB: drill 0.406 mm, clearance 0.203 mm to class 0, clearance 0.406 mm
2 gnd: width 0.305 mm, drill 0.406 mm, clearance 0.203 mm to class 0, clearance 0.203 mm
3 usbvcc: width 0.61 mm, drill 0.508 mm, clearance 0.203 mm to class 0, clearance 0.254 mm

## Board
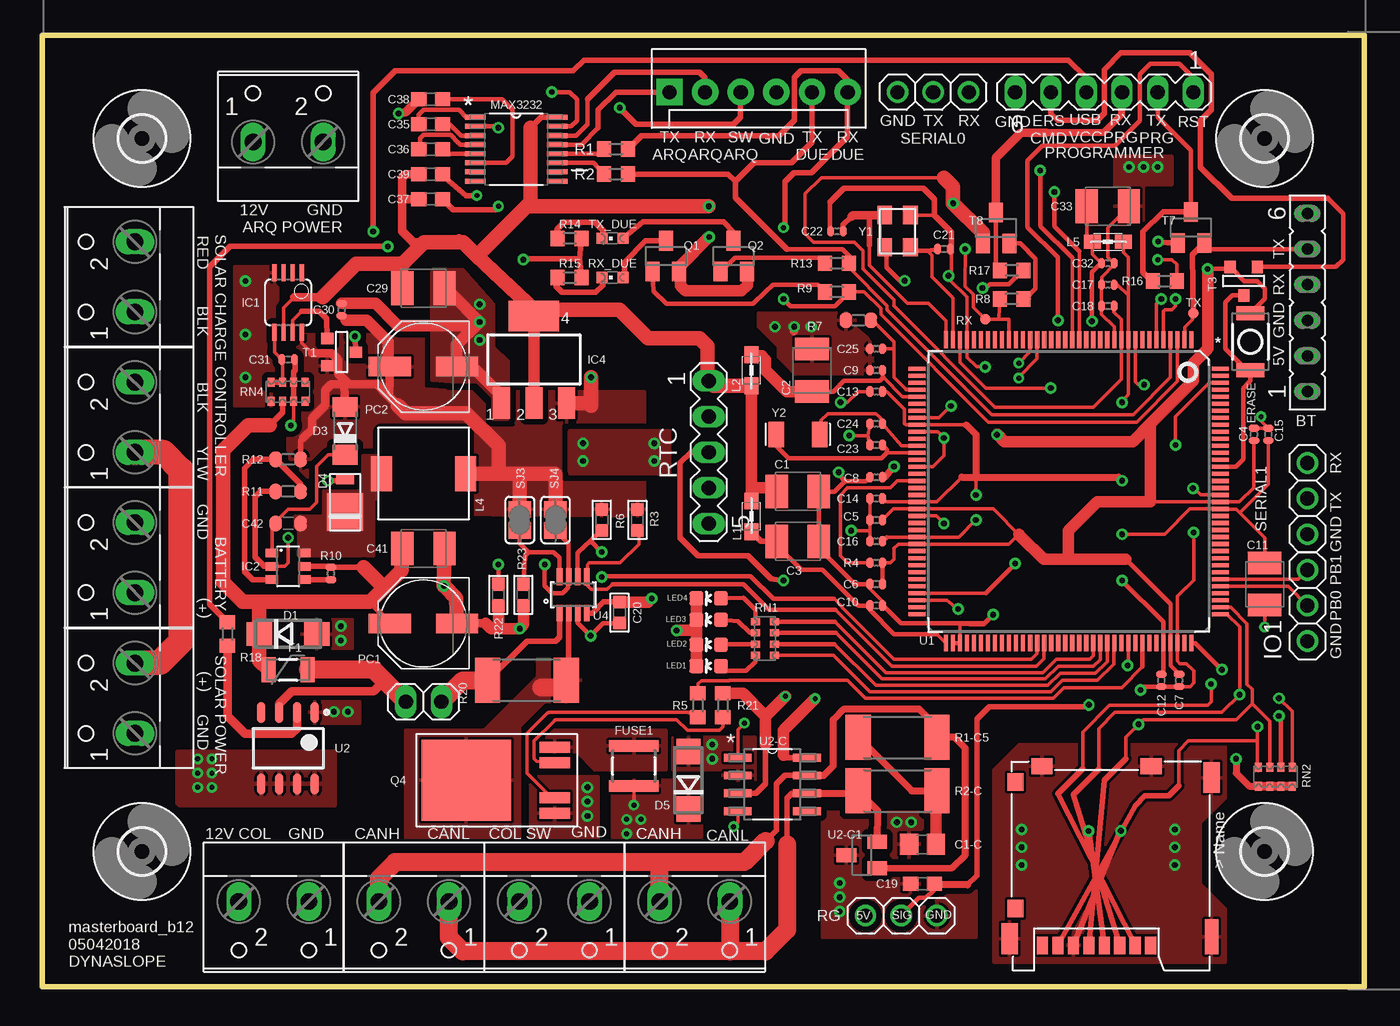
[diagram p2: board, top side]
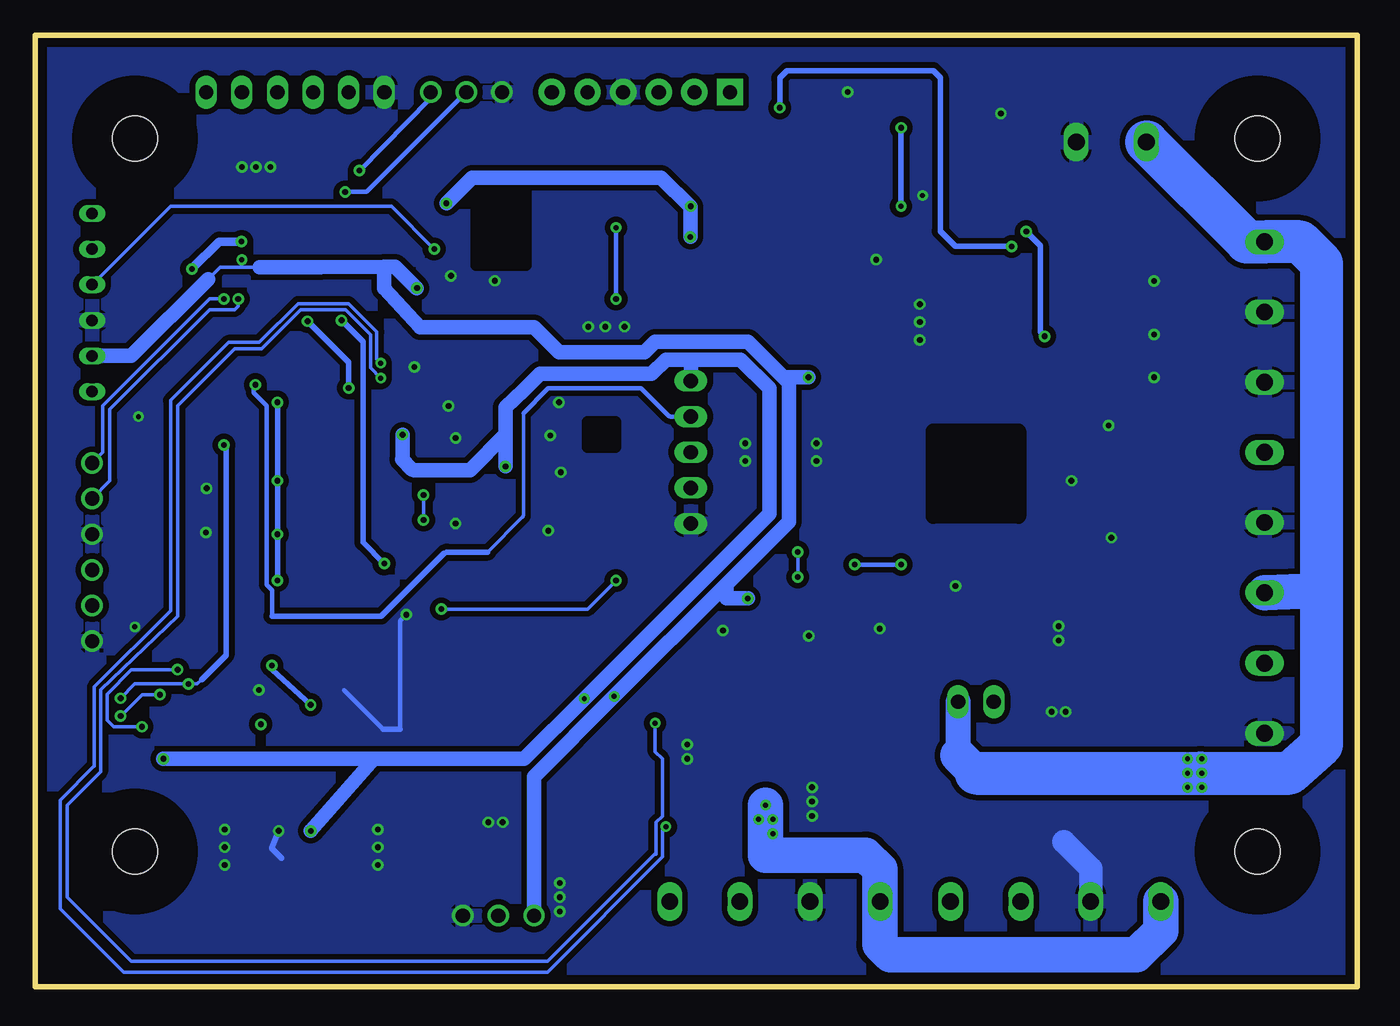
[diagram p3: board, bottom side, seen from below]

Size 94.23 x 67.82 mm. Coordinates in mm from the lower left corner, seen from the top.
Outline: 0,0 0,67.82 94.23,67.82 94.23,0 0,0
Copper layers (1*16): Top 0.035mm / dielectric 0.2mm / Bottom 0.035mm
Design rules "default *": minimum track width 8mil, minimum drill 16mil, track to track 8mil, track to pad 4mil, pad to pad 6mil, via to via 8mil, smd to smd 6mil, copper to edge 25mil, drill to drill 12mil, minimum pad ring 8mil, minimum via ring 8mil, stop-mask expansion 2mil, vias tented up to drill 25mil, thermal gap 8mil
tRestrict: area 59.3,51.4 to 62.8,56; area 24.1,33.5 to 30.2,39.6
bRestrict: area 59.3,51.4 to 62.8,56; area 24.1,33.5 to 30.2,39.6

### Footprints (pad centres in the part's own frame; a part is rotated, then mirrored left to right if it is on the bottom)
MOLEX-1X6 = drill 1.016 pad 1.88 square: 1 0,0 | drill 1.016 pad 1.88: 2 2.54,0; 3 5.08,0; 4 7.62,0; 5 10.16,0; 6 12.7,0
FE06 = drill 0.813 long: 1 -6.35,0; 2 -3.81,0; 3 -1.27,0; 4 1.27,0; 5 3.81,0; 6 6.35,0
SMC_B = smd 1.6 x 2.4: + -1.5,0; - 1.5,0
C0805 = smd 1.3 x 1.5: 1 -0.95,0; 2 0.95,0
C0402 = smd 0.508 x 0.762: 1 -0.445,0; 2 0.445,0
C0603 = smd 1.1 x 1: 1 -0.85,0; 2 0.85,0
0603-MINI = smd 0.9 x 0.9: 1 -0.75,0; 2 0.75,0
C0603-ROUND = smd 0.898 x 1.1: 1 -0.889,0; 2 0.889,0
DO214AC = smd 1.8 x 1.7: A 2.05,0; C -2.05,0
MINIMELF = smd 1.4 x 1.8: A 1.7,0; C -1.7,0
DO220AAL = smd 2.667 x 2.54: P$1 -0.7,0 | smd 0.762 x 1.27: P$2 1.65,0
SMD_157SW = smd 1.016 x 1.981: 1 -2.032,0; 2 2.032,0
PTC-1206 = smd 1 x 1.8: 1 -1.4,0; 2 1.4,0
1812X7R = smd 0.8 x 3.5: 1 -1.425,0; 2 1.425,0
3,2 = hole 3.2: 0,0
MSOP08 = smd 0.3 x 1.2: 1 -0.976,-2.113; 2 -0.326,-2.113; 3 0.324,-2.113; 4 0.974,-2.113; 5 0.974,2.112; 6 0.324,2.112; 7 -0.326,2.112; 8 -0.976,2.112
SOT23-6 = smd 0.6 x 0.9: 1 -0.95,-1.15; 2 0,-1.15; 3 0.95,-1.15; 4 0.95,1.15; 5 0,1.15; 6 -0.95,1.15
SOT223 = smd 1.219 x 2.235: 1 -2.311,-3.099; 2 0,-3.099; 3 2.311,-3.099 | smd 3.6 x 2.2: 4 0,3.099
1X03 = drill 1.016: 1 -2.54,0; 2 0,0; 3 2.54,0
1X02 = drill 1.016 long: 1 -1.27,0; 2 1.27,0
0805 = smd 1.2 x 1: 1 -1.1,0; 2 1.1,0
SRR0604 = smd 1.5 x 2.5: P$1 3,0; P$2 -3,0
LED-0603 = smd 1 x 1: A 0,-0.877; C 0,0.877
SOP65P640X120-16N = smd 1.473 x 0.356: 1 -2.921,2.286; 2 -2.921,1.626; 3 -2.921,0.965; 4 -2.921,0.33; 5 -2.921,-0.33; 6 -2.921,-0.965; 7 -2.921,-1.626; 8 -2.921,-2.286; 9 2.921,-2.286; 10 2.921,-1.626; 11 2.921,-0.965; 12 2.921,-0.33; 13 2.921,0.33; 14 2.921,0.965; 15 2.921,1.626; 16 2.921,2.286
PANASONIC_D = smd 3 x 1.4: + 2.4,0; - -2.4,0
MA06-1 = drill 1.016 long: 1 -6.35,0; 2 -3.81,0; 3 -1.27,0; 4 1.27,0; 5 3.81,0; 6 6.35,0
SOT23 = smd 1 x 1.4: 1 -0.95,-1.1; 2 0.95,-1.1; 3 0,1.1
DPAK-5LEAD = smd 0.787 x 2.184: 1 -2.362,-2.489; 2 -1.245,-2.489; 4 1.245,-2.489; 5 2.362,-2.489 | smd 5.791 x 6.401: 3 0,3.81
R0603 = smd 1 x 1.1: 1 -0.85,0; 2 0.85,0
R2512 = smd 1.8 x 3.2: 1 -2.8,0; 2 2.8,0
R0402 = smd 0.508 x 0.762: 1 -0.445,0; 2 0.445,0
R0603-ROUND = smd 0.898 x 1.1: 1 -0.889,0; 2 0.889,0
2512 = smd 1.8 x 3.2: 1 -2.8,0; 2 2.8,0
CAT16 = smd 0.5 x 0.65: 1 -1.2,-0.675; 2 -0.4,-0.675; 3 0.4,-0.675; 4 1.2,-0.675; 5 1.2,0.675; 6 0.4,0.675; 7 -0.4,0.675; 8 -1.2,0.675
MA05-1 = drill 1.016 long: 1 -5.08,0; 2 -2.54,0; 3 0,0; 4 2.54,0; 5 5.08,0
CHIPLED_0603 = smd 0.8 x 0.8: A 0,-0.75; C 0,0.75
SOLDERJUMPER_REFLOW_NOPASTE = smd 1.168 x 1.6: 1 -0.762,0; 2 0.762,0
SOT-23 = smd 0.787 x 0.889: 1 0.025,-1.016; 2 -0.94,1.016; 3 0.991,1.016
PAD.03X.03 = smd 0.762 x 0.762: P$1 0,0
LQFP144 = smd 0.3 x 1.2: 1 -8.75,-10.8; 2 -8.25,-10.8; 3 -7.75,-10.8; 4 -7.25,-10.8; 5 -6.75,-10.8; 6 -6.25,-10.8; 7 -5.75,-10.8; 8 -5.25,-10.8; 9 -4.75,-10.8; 10 -4.25,-10.8; 11 -3.75,-10.8; 12 -3.25,-10.8; 13 -2.75,-10.8; 14 -2.25,-10.8; 15 -1.75,-10.8; 16 -1.25,-10.8; 17 -0.75,-10.8; 18 -0.25,-10.8; 19 0.25,-10.8; 20 0.75,-10.8; 21 1.25,-10.8; 22 1.75,-10.8; 23 2.25,-10.8; 24 2.75,-10.8; 25 3.25,-10.8; 26 3.75,-10.8; 27 4.25,-10.8; 28 4.75,-10.8; 29 5.25,-10.8; 30 5.75,-10.8; 31 6.25,-10.8; 32 6.75,-10.8; 33 7.25,-10.8; 34 7.75,-10.8; 35 8.25,-10.8; 36 8.75,-10.8; 73 8.75,10.8; 74 8.25,10.8; 75 7.75,10.8; 76 7.25,10.8; 77 6.75,10.8; 78 6.25,10.8; 79 5.75,10.8; 80 5.25,10.8; 81 4.75,10.8; 82 4.25,10.8; 83 3.75,10.8; 84 3.25,10.8; 85 2.75,10.8; 86 2.25,10.8; 87 1.75,10.8; 88 1.25,10.8; 89 0.75,10.8; 90 0.25,10.8; 91 -0.25,10.8; 92 -0.75,10.8; 93 -1.25,10.8; 94 -1.75,10.8; 95 -2.25,10.8; 96 -2.75,10.8; 97 -3.25,10.8; 98 -3.75,10.8; 99 -4.25,10.8; 100 -4.75,10.8; 101 -5.25,10.8; 102 -5.75,10.8; 103 -6.25,10.8; 104 -6.75,10.8; 105 -7.25,10.8; 106 -7.75,10.8; 107 -8.25,10.8; 108 -8.75,10.8 | smd 1.2 x 0.3: 37 10.8,-8.75; 38 10.8,-8.25; 39 10.8,-7.75; 40 10.8,-7.25; 41 10.8,-6.75; 42 10.8,-6.25; 43 10.8,-5.75; 44 10.8,-5.25; 45 10.8,-4.75; 46 10.8,-4.25; 47 10.8,-3.75; 48 10.8,-3.25; 49 10.8,-2.75; 50 10.8,-2.25; 51 10.8,-1.75; 52 10.8,-1.25; 53 10.8,-0.75; 54 10.8,-0.25; 55 10.8,0.25; 56 10.8,0.75; 57 10.8,1.25; 58 10.8,1.75; 59 10.8,2.25; 60 10.8,2.75; 61 10.8,3.25; 62 10.8,3.75; 63 10.8,4.25; 64 10.8,4.75; 65 10.8,5.25; 66 10.8,5.75; 67 10.8,6.25; 68 10.8,6.75; 69 10.8,7.25; 70 10.8,7.75; 71 10.8,8.25; 72 10.8,8.75; 109 -10.8,8.75; 110 -10.8,8.25; 111 -10.8,7.75; 112 -10.8,7.25; 113 -10.8,6.75; 114 -10.8,6.25; 115 -10.8,5.75; 116 -10.8,5.25; 117 -10.8,4.75; 118 -10.8,4.25; 119 -10.8,3.75; 120 -10.8,3.25; 121 -10.8,2.75; 122 -10.8,2.25; 123 -10.8,1.75; 124 -10.8,1.25; 125 -10.8,0.75; 126 -10.8,0.25; 127 -10.8,-0.25; 128 -10.8,-0.75; 129 -10.8,-1.25; 130 -10.8,-1.75; 131 -10.8,-2.25; 132 -10.8,-2.75; 133 -10.8,-3.25; 134 -10.8,-3.75; 135 -10.8,-4.25; 136 -10.8,-4.75; 137 -10.8,-5.25; 138 -10.8,-5.75; 139 -10.8,-6.25; 140 -10.8,-6.75; 141 -10.8,-7.25; 142 -10.8,-7.75; 143 -10.8,-8.25; 144 -10.8,-8.75
INF-PG-DSO-8-24_L_1PRIMARY = smd 1.5 x 0.6: 1 -2.55,1.905; 2 -2.55,0.635; 3 -2.55,-0.635; 4 -2.55,-1.905; 5 2.55,-1.905; 6 2.55,-0.635; 7 2.55,0.635; 8 2.55,1.905
SOIC8 = smd 1.981 x 0.559: 1 -0.464,4.405; 2 -0.464,3.135; 3 -0.464,1.865; 4 -0.464,0.595; 5 4.464,0.595; 6 4.464,1.865; 7 4.464,3.135; 8 4.464,4.405
SOT23-8 = smd 0.4 x 1.2: 1 -0.975,-1.3; 2 -0.325,-1.3; 3 0.325,-1.3; 4 0.975,-1.3; 5 0.975,1.3; 6 0.325,1.3; 7 -0.325,1.3; 8 -0.975,1.3
SPARKFUN-CONNECTORS_503182-1853 = smd 0.8 x 1.24: 1 4.68,7.02; 2 3.58,7.02; 3 2.48,7.02; 4 1.38,7.02; 5 0.28,7.02; 6 -0.82,7.02; 7 -1.92,7.02; 8 -3.02,7.02 | smd 1.16 x 1.25: CD1 6.62,-4.61; CD2 6.62,4.39 | smd 0.95 x 2.5: SHIELD@1 -7.365,6.39 | smd 1.15 x 2.2: SHIELD@2 -7.365,-4.94; SHIELD@5 7.025,6.54 | smd 1.5 x 1.15: SHIELD@3 -3.06,-5.735; SHIELD@4 4.72,-5.735
W237-102 = drill 1.194 long: 1 -2.5,-1.27; 2 2.5,-1.27
CRYSTAL-3.2-2.5 = smd 1.3 x 1.05: 1 -1.15,-0.925; 2 1.15,-0.925; 3 1.15,0.925; 4 -1.15,0.925
RESONATOR_EPSON_FC_145 = smd 1.1 x 1.8: P$1 -1.55,0; P$2 1.55,0

### Placement (x,y rotation side)
ARQ_TERMINAL  44.7,63.75 0 top
BT  90.17,48.77 90 top
C1  53.85,35.31 0 top
C1-C  62.74,10.16 180 top
C2  54.86,43.94 90 top
C3  53.85,31.75 0 top
C4  86.36,39.37 270 top
C5  59.44,33.27 0 top
C6  59.44,28.7 0 top
C7  81.03,21.84 90 top
C8  59.44,36.32 0 top
C9  59.44,43.94 0 top
C10  59.44,27.18 180 top
C11  87.12,28.7 270 top
C12  79.76,21.84 90 top
C13  59.44,42.42 0 top
C14  59.44,34.8 0 top
C15  87.38,39.37 270 top
C16  59.44,31.75 0 top
C17  75.95,50.04 0 top
C18  75.95,48.51 0 top
C19  62.74,7.37 180 top
C20  41.15,26.67 270 top
C21  64.26,52.58 0 top
C22  56.64,53.85 180 top
C23  59.44,38.61 180 top
C24  59.44,40.13 180 top
C25  59.44,45.47 180 top
C29  27.18,49.78 0 top
C30  21.34,48.26 270 top
C31  17.53,44.7 180 top
C32  75.95,51.56 180 top
C33  75.95,55.63 0 top
C35  27.69,61.47 0 top
C36  27.69,59.69 0 top
C37  27.69,56.13 0 top
C38  27.69,63.25 0 top
C39  27.69,57.91 0 top
C41  27.18,31.24 0 top
C42  17.53,33.02 0 top
D1  17.53,25.15 0 top
D3  21.59,39.62 90 top
D4  21.59,34.54 90 top
D5  46.06,14.73 90 top
ERASE  86.11,45.97 270 top
F1  17.53,22.61 0 top
FUSE1  42.16,15.75 270 top
H1  7.11,9.65 0 top
H2  7.11,60.45 0 top
H3  87.12,9.65 0 top
H4  87.12,60.45 0 top
IC1  17.53,48.77 180 top
IC2  17.53,29.97 270 top
IC4  35.05,44.7 0 top
IO1  90.17,27.18 90 top
JP2  27.18,20.32 180 top
L1  50.55,33.53 270 top
L2  50.55,43.94 90 top
L4  27.18,36.58 180 top
L5  75.95,53.09 180 top
LED1  47.5,22.86 90 top
LED2  47.5,24.38 90 top
LED3  47.5,26.16 90 top
LED4  47.5,27.69 90 top
MAX3232  33.78,59.69 0 top
PC1  27.18,25.91 180 top
PC2  27.18,44.2 180 top
PROGRAMMER  75.69,63.75 180 top
Q1  44.45,52.07 0 top
Q2  49.28,52.07 0 top
Q4  34.04,14.73 90 top
R1  40.89,59.69 0 top
R1-C5  60.96,17.78 0 top
R2  40.89,57.91 0 top
R2-C  60.96,13.97 0 top
R3  42.42,33.27 90 top
R4  59.44,30.23 0 top
R5  46.74,20.07 270 top
R6  39.88,33.27 270 top
R7  58.17,47.5 0 top
R8  69.09,49.02 0 top
R9  56.64,49.53 0 top
R10  20.57,29.46 270 top
R11  17.53,35.31 180 top
R12  17.53,37.59 180 top
R13  56.64,51.56 0 top
R14  37.59,53.34 180 top
R15  37.59,50.55 180 top
R16  80.01,50.29 0 top
R17  69.09,51.05 0 top
R18  13.21,25.15 270 top
R20  34.54,21.84 180 top
R21  48.51,20.07 90 top
R22  32.51,27.94 90 top
R23  34.29,27.94 90 top
RG  61.21,5.08 0 top
RN1  51.5,24.82 90 top
RN2  87.88,14.99 0 top
RN4  17.53,42.42 180 top
RTC  47.5,38.1 270 top
RX_DUE  40.64,50.55 90 top
SERIAL0  63.5,63.75 180 top
SERIAL1  90.17,34.8 270 top
SJ3  34.04,33.27 270 top
SJ4  36.58,33.27 270 top
T1  21.34,45.21 90 top
T3  85.6,50.29 0 top
T7  81.87,54.11 0 top
T8  67.98,54.07 0 top
TP3  82.04,48.01 0 top
TP4  67.21,47.57 0 top
TX_DUE  40.64,53.34 90 top
U1  73.15,35.31 180 top
U2  17.53,17.02 270 top
U2-C  50.04,11.94 0 top
U2-C1  58.42,9.4 90 top
U4  37.85,27.94 0 top
U$9  75.97,9.98 180 top
X1  46.51,4.83 180 top
X2  5.33,40.59 90 top
X3  5.33,50.59 90 top
X4  5.33,20.57 90 top
X5  5.33,30.59 90 top
X6  17.53,61.47 0 top
X7  36.51,4.83 180 top
X11  16.51,4.83 180 top
X12  26.49,4.83 180 top
Y1  60.96,53.85 270 top
Y2  53.85,39.37 0 top

### Tracks (layer width: path | path; a pad name or v marks a point on that pad's centre or on a via)
5V  (via drill 0.35, 0.41)
  Top 0.254: 38.86,26.68 U4.4 | IC1.8 18.5,45.9 19.25,45.16 | C30.2 21.46,47.69 | R16.2 80.86,51.47 80.52,51.82 v79.5,51.82
  Top 0.305: 34.04,34.42 SJ3.1 | R17.2 68.9,50.06 67.53,50.06 67.27,49.81 v67.01,49.81
  Top 0.406: 24.64,44.15 PC2.+ | U4.4 39.21,26.64 40.01,27.43 41.14,27.43 C20.1 | U2-C.3 50.89,13.8 51.56,14.48 51.56,17.27 | R12.1 18.41,38.92 18.61,39.12
  Top 0.508: 21.65,47.5 21.46,47.69
  Top 0.61: 18.61,39.12 19.24,39.75 19.24,40.51 20.18,41.45 20.18,42.53 20.57,42.93 21.59,42.93 | 39.74,34.04 R6.1 | 24.63,42.16 25.34,41.45 | 24.63,42.16 23.86,42.93 21.84,42.93 | 21.84,42.93 21.08,43.69 21.08,44.2 | 21.08,44.2 21.08,44.7 20.63,45.16 19.25,45.16 | 21.59,42.93 21.84,42.93 | D3.A 21.53,42.86 21.59,42.93 | T1.2 20.31,44.2 21.08,44.2 | PC2.+ 24.71,42.24 24.63,42.16
  Top 0.813: C20.1 43.17,27.42 v43.43,27.69 | 51.56,19.3 v52.96,20.7 | R21.2 49.95,20.92 51.56,19.3 | 51.56,17.27 51.56,19.3 | PC2.+ 24.64,44.34 24.64,45.97 23.11,47.5 21.65,47.5
  Top 1.016: v39.12,43.43 39.12,41.4 38.91,41.6 IC4.3 | SJ4.1 36.58,36.51 36.51,36.58 34.04,36.58 | L4.P$2 32.52,36.58 | 25.34,41.45 25.89,40.89 30.23,40.89 32.52,38.6 32.52,36.58 | 32.52,36.58 34.04,36.58 | SJ3.1 34.04,36.58
  Bottom 0.254: 78.23,51.3 79.5,51.3 | 79.5,51.3 81.04,51.3 81.92,50.42 | v79.5,51.82 79.5,51.3
  Bottom 0.61: 67.05,49.77 v67.01,49.81
  Bottom 1.016: 69.34,51.3 73.89,51.3 78.23,51.3 | 69.34,51.3 68.58,51.31 67.05,49.78 67.05,49.77 | 44.96,28.7 44.96,27.69 v43.43,27.69 | 81.92,50.42 87.38,44.96 BT.2 | 44.96,28.7 40.51,33.15 40.51,43.05 40.89,43.43 | 44.96,28.7 v52.96,20.7 58.67,14.99 RG.1 | 40.89,43.43 43.43,45.97 50.04,45.97 50.8,45.21 56.9,45.21 58.67,46.99 66.8,46.99 69.34,49.78 69.34,51.3 | v39.12,43.43 40.89,43.43
  pour Top (isolate 0.406, rank 6): 17.53,46.48 28.7,46.48 28.7,42.42 42.93,42.42 42.93,33.53 17.53,33.78
12V_COL  (via drill 0.35)
  Top 0.254: FUSE1.2 v42.16,12.95
  Bottom 2.54: v42.16,12.95 42.16,9.4 35.05,9.4 34.03,8.38 X7.2 34.03,3.04 33.27,2.29 15.75,2.29 14.01,4.02 X11.2
  other vias: 42.67,11.94 41.66,11.94 41.66,10.92
  pour Top (isolate 0.127): 40.64,14.73 46.99,14.73 46.99,10.67 40.64,10.67
+3V3  (via drill 0.35, 0.41, 0.41 pad 0.3, 0.41 pad 0.41)
  Top 0.254: C5.2 60.66,34.06 U1.57 67.8,34.06 69.72,32.13 | R4.2 60.45,30.23 60.71,30.48 60.71,31.24 61.02,31.56 U1.62 68.89,31.56 69.6,32.26 | C18.2 76.39,48.07 76.9,47.56 U1.11 76.9,43.29 74.93,41.32 67.9,41.32 60.7,48.52 60.7,48.97 58.51,51.16 58.51,52.44 57.9,53.05 54.98,53.05 54.38,53.65 54.38,56.52 55.53,57.67 64.26,57.67 | 78.99,34.56 U1.125 | 83.96,34.54 U1.125 | v74.59,11.12 | IC1.6 17.2,48.38 17.97,49.15 | U1.125 85.33,34.56 86.36,35.58 C4.2
  Top 0.279: 80.4,27.29 U1.105 80.4,22.91 C7.2
  Top 0.305: 59.9,36.56 C8.2 | C6.2 R4.2 | 77.22,30.48 80.4,27.29 | v83.06,51.16 84.51,51.16 T3.2 85.67,50.29 86.61,50.29 87.12,49.78 87.12,49.02 ERASE.1
  Top 0.406: 50.55,35.05 L1.1 | C1.+ 52.35,35.79 | T7.1 80.18,53.01 v79.52,53.11 | 45.48,50.62 Q1.2 | U$9.5 v74.59,11.12 | MAX3232.16 35.56,61.98 34.8,61.21 | U2-C.8 53,16.34 52.83,16.51
  Top 0.508: v60.71,37.08 60.06,36.32 C8.2 | RN2.1 86.02,14.31 85.09,15.24 v85.09,16.26
  Top 0.61: 17.97,49.15 20,49.15 | RN2.4 RN2.3 RN2.2 RN2.1 | 30.99,52.08 30.99,52.07 | 29.72,53.34 29.99,53.07 | 27.21,53.07 26.43,53.07 25.65,53.85 25.65,56.13 | 25.65,56.13 25.65,57.66 25.91,57.91 C39.1 | C37.1 25.65,56.13
  Top 0.813: 78.99,40.13 82.04,43.18 82.04,44.45 83.06,45.47 v83.06,51.16 | 78.99,40.13 77.72,38.86 68.58,38.86 68.07,39.37 v68.05,39.34 | 73.15,30.48 71.37,30.48 69.72,32.13 69.6,32.26 | 73.15,30.48 73.15,32.51 75.2,34.56 78.99,34.56 78.99,40.13 | 77.22,30.48 73.15,30.48 | IC4.4 IC4.2 | v47.54,53.44 45.48,51.38 45.48,50.62 45.48,49.97 45.86,49.59 49.84,49.59 50.26,50.01 Q2.2 | L2.1 50.55,35.56 | 50.55,35.56 L1.1 | C1.+ 52.09,35.56 50.55,35.56 | 47.41,43.27 RTC.1 | 29.99,53.07 29.97,53.07 | C29.+ 25.68,51.53 | 52.83,16.51 52.83,18.29 v55.09,20.55
  Top 1.016: 64.26,57.67 64.92,57.02 v64.92,55.84 67.03,53.73 T8.1 | v47.5,55.63 34.53,55.63 | IC4.4 35.05,48.26 | 47.41,43.27 47.41,45.66 46.84,46.23 43.18,46.23 41.15,48.26 35.05,48.26 | 34.8,61.21 34.8,55.89 34.53,55.63 | 35.05,48.26 30.99,52.07 29.99,53.07 | 29.97,53.07 27.21,53.07 25.68,51.53 22.39,51.53 20,49.15 | 34.53,55.63 30.99,52.08 | RTC.1 47.84,42.84 L2.1
  Bottom 0.61: v83.06,51.16 81.11,53.11 v79.52,53.11
  Bottom 0.813: 47.52,53.46 v47.54,53.44 | v64.93,55.85 v64.92,55.84 | 47.54,55.59 v47.5,55.63
  Bottom 1.016: v47.54,53.44 47.54,55.59 49.61,57.66 63.09,57.66 v64.92,55.84 | v74.59,11.12 70.07,16.26 | RTC.1 47.5,44.7 | 47.5,44.7 43.94,44.7 41.91,42.67 41.91,33.73 v55.09,20.55 59.38,16.26 70.07,16.26 | 47.5,44.7 49.28,44.7 50.29,43.69 58.25,43.69 59.44,42.51 60.71,41.29 60.71,39.37 | v85.09,16.26 70.07,16.26 | v68.05,39.34 68.05,37.62 68.07,37.59 67.38,36.9 arc-45 67.2,36.83 63.25,36.83 60.71,39.37 | 60.71,39.37 v60.71,37.08
BOOST
  Top 0.254: IC2.1 16.38,32.76 C42.1 16.83,33.34 17.53,34.04 19.05,34.04 19.56,34.54 19.56,37.1 20.38,37.92 D3.C
CANH
  Top 0.254: 63.76,18.54 R1-C5.2
  Top 0.406: U2-C.7 52.92,15.07 52.32,14.48 52.32,11.18 51.56,10.41
  Top 0.508: 63.76,18.54 62.48,19.81 57.15,19.81 56.39,19.05 56.39,15.75 55.71,15.07 U2-C.7 | U2-C1.1 64.89,8.5 65.79,9.4 65.79,17.02 65.02,17.78 R1-C5.2
  Top 1.27: 51.56,10.41 50.04,8.89 43.94,8.89 | 43.94,8.89 25.15,8.89 24.07,7.81 arc45 23.99,7.63 X12.2 | 44.03,8.8 44.01,8.82 | X1.2 44.01,8.82 | 44.01,8.82 43.94,8.89
CANL
  Top 0.406: 57.56,14.56 R2-C.1 | U2-C.6 53.43,13.8 53.09,13.46 53.09,10.16
  Top 0.508: U2-C1.2 59.56,12.57 58.29,13.84 | 58.29,13.84 R2-C.1 | U2-C.6 58.25,13.8 58.29,13.84
  Top 1.27: 53.09,10.16 53.09,4.06 51.56,2.54 49.02,2.54 | 49.02,2.54 29.97,2.54 28.99,3.52 X12.1 | X1.1 49.01,2.56 49.02,2.54
CANRX0  (via drill 0.35)
  Top 0.254: U2-C.4 49.57,11.73 v49.28,11.43 | U1.24 70.4,45.26 v69.6,44.45
  Bottom 0.254: v69.6,44.45 69.88,44.73 69.88,46.67 71.9,48.69 75.49,48.69 78.26,45.92 80.45,45.92 84.58,41.8 84.58,26.81 90.02,21.38 90.02,15.75 | v49.28,11.43 49.53,11.18 49.53,9.26 57.72,1.07 81.22,1.07 87.94,1.07 92.46,5.59 92.46,13.31 90.02,15.75 | 90.02,15.75 90.02,15.72
CANTX0  (via drill 0.35)
  Top 0.254: U2-C.1 49.57,18.33 v50.04,18.8 | v69.6,43.38 69.6,43.45 70.9,44.75 U1.23
  Bottom 0.254: v69.6,43.38 70.33,44.12 70.33,46.48 72.08,48.23 75.31,48.23 78.07,45.47 80.01,45.47 84.07,41.4 84.07,26.42 89.56,21.19 89.56,15.98 89.56,15.34 91.95,12.95 91.95,6.4 87.38,1.83 57.71,1.83 49.98,9.55 | 49.98,9.45 49.98,9.55 | v50.04,18.8 50.04,16.76 49.53,16.26 49.53,12.18 49.98,11.72 49.98,9.65 49.98,9.55
CC_IN
  Top 1.778: X4.2 8.38,23.11 9.91,24.64 9.91,36.83 8.65,38.09 X2.1
CC_OUT  (via drill 0.35)
  Top 0.406: U4.1 36.87,24.93 36.58,24.64 34.54,24.64 R20.2
  Top 1.27: JP2.1 29.97,21.84 R20.2
  Bottom 1.778: JP2.1 28.45,16.51 | v11.08,15.24 11.18,15.24
  Bottom 2.54: 28.45,16.51 27.18,15.24 | X5.1 3.1,28.25 2.54,28.19
  Bottom 3.048: X6.1 14.99,60.2 7.88,53.09 X3.2 4.07,53.09 2.54,51.56 2.54,28.19 2.54,17.27 4.83,15.24 11.18,15.24 27.18,15.24
  other vias: 12.1,15.24 12.1,16.26 11.08,16.26 11.08,14.22 12.1,14.22
  pour Top: 9.65,16.76 9.65,12.95 20.83,12.95 20.83,16.76
CC_OUT1
  Top 0.406: U4.2 37.52,22.02 R20.1
  Top 1.27: R20.1 36.84,21.34 35.56,21.34
  pour Top (isolate 0.127): 34.04,10.67 34.04,18.54 35.81,20.32 38.35,20.32 38.35,23.37 35.31,23.37 35.31,22.1 31.5,18.29 25.91,18.29 25.91,10.67
CMP
  Top 0.254: RN4.3 17.13,44.66 C31.2 16.55,45.23 IC1.5
  Top 0.406: RN4.4 RN4.3
COL-SW
  Top 0.254: 78.4,22.8 76.94,21.34 72.83,21.34 72.07,20.57 58.67,20.57 57.4,21.84 48.99,21.84 48.98,21.83 46.98,21.83 46.74,21.59 R5.1
  Top 0.305: U1.101 78.4,22.8
DIAG-COL_SW
  Top 0.254: Q4.4 35.23,16.08 35.05,16.26 35.05,17.53 36.5,18.98 arc-45 36.68,19.05 45.21,19.05 45.97,18.29 48.26,18.29 48.51,18.54 R21.1
DUE_SW  (via drill 0.41)
  Top 0.406: ARQ_TERMINAL.3 49.78,61.98 49.28,61.47 42.34,61.47 v41.16,62.64 | v24.64,52.76 13.39,52.76 11.94,51.31 11.94,27.27 R18.1
  Bottom 0.406: v24.64,52.76 28.63,52.76 29.72,53.85 29.72,64.77 30.23,65.28 40.64,65.28 41.15,64.77 41.15,64.69 v41.16,62.64
EN
  Top 0.406: IC2.4 R10.2
ERASE_CMD
  Top 0.305: 91.62,56.19 92.71,55.09 92.71,51.82 92.2,51.31 T3.3
  Top 0.406: PROGRAMMER.5 71.88,62.23 72.37,61.74 75.18,61.74 75.69,62.25 75.69,65.35 76.89,66.55 81.79,66.55 83.31,65.02 83.31,62.48 82.55,61.72 82.55,58.42 84.78,56.19 91.62,56.19
ERASE_S
  Top 0.305: U1.130 85.06,37.06 85.6,37.59 85.6,42.67 86.11,43.18 ERASE.2 85.85,43.94 84.33,45.47 84.33,48.77 84.84,49.28 T3.1
FB
  Top 0.406: IC2.3 14.98,29.02 14.41,29.59 14.41,36.96 15.05,37.59 R12.2 18.41,35.81 R11.1
GATE_CMD
  Top 0.254: IC1.7 17.85,47.51 18.48,48.13
  Top 0.406: 18.48,48.13 19.75,48.13 20.26,47.62 T1.3
GND  (via drill 0.35, 0.41, 0.41 pad 0.41)
  Top 0.254: U1.12 76.4,47.04 75.5,47.94 C18.1 C17.1 75.51,50.57 76.39,51.45 C32.1 75.95,52.01 75.95,54.1 77.45,55.6 C33.- | C10.1 59.88,27.5 58.99,28.38 C6.1 | v64.26,33.02 63.73,33.56 U1.58 | C24.2 58.85,39.29 | 58.85,39.29 C23.2 | v57.52,39.29 58.85,39.29 | C14.1 C5.1 58.99,32.51 | 58.99,32.51 C16.1 | v57.66,32.51 58.99,32.51 | U1.44 63.92,40.56 v64.77,41.4 | U1.46 63.82,39.56 v64.26,39.12 64.26,37.85 63.47,37.06 U1.51 | C13.1 58.17,42.42 57.4,41.66 v56.9,41.66 | 55.12,35.31 55.12,35.28 C1.- | 64.85,52.51 C21.2 64.78,52.34 64.78,50.86 v64.59,50.67 64.59,50.47 65.9,49.16 U1.33 65.9,44.87 66.6,44.18 v67.2,44.18 | U1.126 82.58,35.06 82.11,35.53 v82.01,35.53 | C20.2 41.15,25.91 | 63.58,54.98 62.08,54.98 Y1.4 | U1.75 65.4,25.78 65.49,25.86 | C7.1 81.81,21.4 82.08,21.67 82.08,22.52 81.55,23.04 81.08,23.04 80.9,23.23 U1.106 80.9,27.84 81.51,28.44 81.54,28.44 82.09,28.99 82.09,32.35 v82.06,32.38 | 76.79,11.04 v76.87,11.12 | IC2.2 17.27,29.97 17.53,30.23 v17.53,32 | RN4.7 17.93,40.22 v17.72,40.01 | C4.1 C15.1 86.87,40.32 v86.87,40.64 | C11.- v87.12,25.65
  Top 0.305: C10.1 59.94,27.18 61.21,25.91 67.16,25.91 v67.78,26.52 67.11,25.86 66.09,25.86 65.49,25.86 | 55.35,35.26 C3.- 55.35,31.27 57.91,28.7 C6.1 | 55.35,35.26 C1.- | MAX3232.15 37.69,61.32 38.1,61.72 38.1,63.25 37.59,63.75 v36.32,63.75 | C7.1 C12.1 78.52,21.4 v78.28,21.16 | C20.2 39.99,25.92 v39.09,25.02 38.17,25.93 U4.3 | Y1.2 60.17,52.5 60.17,51.28 61.13,50.32 v61.47,50.32 | C8.1 58.71,36.04 57.2,36.04 | 57.2,36.04 56.46,35.3 55.39,35.3 55.35,35.26 | 57.2,36.04 56.77,36.48 v56.77,36.67 | U1.74 U1.75 | 56.15,55.89 56.15,53.9 C22.2
  Top 0.406: D4.P$2 21.91,36.07 v20.37,36.07 | C33.- 77.45,55.98 | R14.1 38.31,51.88 | 38.31,51.88 R15.1 | 38.31,51.88 34.35,51.88 v34.29,51.82 | 56.15,55.89 57.15,56.9 62.81,56.9 63.57,56.13 63.57,54.99 63.58,54.98 64.78,53.78 64.78,52.34 | U$9.3 76.79,11.04 | IC2.2 15.81,29.97 15.18,30.61 15.18,34.92 15.56,35.31 R11.2 | RN4.7 RN4.2 17.93,43.83 18.03,43.94 18.03,44.45 C31.1 | C39.2 28.7,57.66 30.23,56.39 v30.99,56.39
  Top 0.61: R7.1 57.28,47.37 | 58.97,45.44 C25.2 | v53.59,47.04 53.59,46.71 | C38.1 25.91,62.32 v25.4,62.23 | PC1.- 31.61,25.91
  Top 0.813: v31.18,47.37 29.17,49.38 28.61,49.38 C29.- | v31.18,47.37 29.52,45.71 PC2.- 30.78,44.07 32.73,42.12 | v31.18,47.37 30.92,47.12 25.34,47.12 23.75,48.7 C30.1 | 77.53,55.6 77.45,55.6 | LED1.C LED2.C 46.62,25.4 | 46.62,25.4 LED3.C LED4.C | v45.21,25.4 46.62,25.4 | 31.61,25.91 31.92,25.6 arc45 32.1,25.53 32.51,25.53 | 32.51,25.53 v34.04,25.53 34.22,25.71 arc45 34.29,25.89 R23.1 | R22.1 32.51,25.53
  Top 1.016: C41.- 28.61,28.6 v28.64,28.57 29.52,27.7 PC1.-
  Bottom 0.305: 72.22,21.16 69.42,18.36 | v67.78,26.52 68.21,26.09 68.21,18.36
  Bottom 0.406: v76.87,11.12 77.38,9.87 76.68,9.16 | 69.42,18.36 68.21,18.36 | X7.1 39.03,6.79
  Bottom 1.676: 20.92,10.33 19.01,8.42 19.01,6.34 X11.1
  other vias: 77.47,58.42 52.22,47.04 54.81,47.04 69.8,11.23 69.8,9.96 69.8,8.69 80.72,11.23 80.72,9.96 80.72,8.69 78.49,58.42 79.5,58.42 31.18,46.1 31.18,48.64 56.85,7.42 56.85,6.4 56.85,5.38 38.86,14.22 47.75,17.27 47.75,16.26 20.78,19.61 21.79,19.61 21.29,24.69 21.29,25.7 60.91,11.73 61.93,11.73 38.86,13.21 38.86,12.19 14.48,50.29 14.48,46.48 14.48,43.43 38.54,38.73 38.54,37.47 43.62,38.73 43.62,37.47
  pour Bottom (isolate 0.406): -0.66,68.71 95.37,68.66 95.13,-0.61 -1.01,-0.45 -0.89,68.99
  pour Top: 52.48,45.62 52.48,44.86 53.64,43.69 59.18,43.69 59.18,45.72 58.78,46.28 57.91,46.99 57.91,48.01 51.05,48.01 51.05,47.04
  pour Top (no thermals): 27.81,51.1 29.98,51.1 32.18,48.64 32.18,45.59 33.2,44.56 33.2,41.01 33.17,40.46 32.2,40.46 32.15,40.51 32.15,41.99 31,43.14 29.15,43.14 27.79,43.23 27.79,47.01 27.76,48.3 27.76,50.79
  pour Top: 69.6,17.27 67.82,15.49 67.82,1.78 84.33,1.78 84.33,5.59 82.55,7.37 82.55,11.68 84.33,13.46 84.33,17.27
  pour Top: 76.45,54.36 78.49,54.36 78.49,57.15 80.52,57.15 80.52,59.18 76.45,59.18
  pour Top (isolate 0.406): 55.63,12.45 66.55,12.45 66.55,3.56 55.63,3.56
  pour Top (isolate 0.127): 34.8,14.99 39.62,14.99 39.62,10.67 34.8,10.67
  pour Top (isolate 0.127): 44.96,17.78 50.8,17.78 50.8,14.73 48.51,14.73 48.51,15.49 44.96,15.49
  pour Top (isolate 0.127): 19.05,20.32 22.61,20.32 22.61,18.8 19.05,18.8
  pour Top (isolate 0.127): 18.54,26.16 22.1,26.16 22.1,24.13 18.54,24.13
  pour Top (isolate 0.406): 13.72,51.31 16.76,51.31 16.76,41.4 13.72,41.4
  pour Top (isolate 0.406): 37.59,36.58 37.59,39.62 44.7,39.62 44.7,36.58
MASTER-RESET  (via drill 0.41, 0.41 pad 0.41)
  Top 0.254: U1.69 67.24,28.06
  Top 0.305: 67.24,28.06 v69.35,30.16 | v72.39,47.5 72.39,51.98 70.23,54.14 70.23,58.87 71.3,59.94 76.45,59.94 78.23,61.72 78.23,65.02 78.99,65.79 81.03,65.79 82.04,64.77 PROGRAMMER.1
  Bottom 0.406: v69.35,30.16 70.87,31.68 70.87,45.97 v72.39,47.5
MISO  (via drill 0.41)
  Top 0.254: 81.01,14.33 81.01,16.84 81.69,17.53 86.61,17.53 | RN2.8 86.68,15.42 86.61,15.49 86.61,17.53 | v86.61,18.54 86.61,17.53
  Top 0.305: U1.108 82.17,24.51 v84.07,22.61
  Top 0.406: 81.01,14.33 80.29,13.61 78.6,13.61 77.89,12.9 U$9.2
  Bottom 0.254: v84.07,22.61 85.34,22.61 87.38,22.59 89.1,20.87 89.1,19 88.65,18.54 v86.61,18.54
MOSI  (via drill 0.41)
  Top 0.254: 75.31,15.52 75.31,18.41 76.45,19.56 84.07,19.56 v85.34,20.83 85.34,25.65 84.44,26.56 U1.109
  Top 0.305: RN2.6 88.28,19.16 v88.14,19.3
  Top 0.406: U$9.6 73.49,13.7 75.31,15.52
  Bottom 0.254: v88.14,19.3 86.61,20.83 v85.34,20.83
N$3
  Top 0.406: Q2.3 49.31,53.75 48.55,54.51 42.83,54.51 TX_DUE.A
N$4
  pour Top (isolate 0.127): 35.56,18.29 44.45,18.29 44.45,15.49 39.37,15.49 38.1,16.76 35.56,16.76
N$6
  Top 0.305: RN1.6 50.44,25.22 49.59,26.07 LED3.A
N$7
  Top 0.254: U1.53 60.95,36.06 60.45,35.56 57.4,35.56 56.9,35.05 56.9,30.73 57.4,30.23 R4.1
N$8
  Top 0.305: R9.1 55.28,50.04 52.07,50.04 51.54,49.54 50.67,48.67 44.49,48.67 43.58,49.59 Q1.1
N$9
  Top 0.406: Q1.3 43,53.15 41.49,51.65 41.49,50.64 RX_DUE.A
N$10
  Top 0.406: R14.2 36.68,53.28 36.68,53.99 37.19,54.5 39.39,54.5 40,53.89 TX_DUE.C
N$11
  Top 0.254: 46.48,19.22 R5.2 46.41,18.89 | 46.48,19.22 | Q4.2 36.2,13.59 34.54,15.24 34.54,18.07 35.96,19.48 arc-45 36.14,19.56 46.03,19.56 arc-45 46.21,19.48 46.48,19.22
N$12
  Top 0.305: R8.2 70.05,49 | 70.05,49 70.33,49 | T8.2 69.7,52.97 70.79,51.89 70.79,49.73 70.05,49
N$13
  Top 0.305: C35.1 26.84,62.14 27.18,62.48 29.72,62.48 30.23,61.98 MAX3232.1
N$14
  Top 0.305: MAX3232.3 29.86,60.66 29.04,61.47 C35.2
N$15
  Top 0.305: MAX3232.4 29.79,60.02 29.67,60.15 29.65,60.15 29.09,60.71 27.18,60.71 26.92,60.45 26.92,59.78 C36.1
N$16
  Top 0.305: 30.66,59.36 MAX3232.5 28.97,59.36 C36.2
N$17
  Top 0.406: RX_DUE.C 39.95,50.01 39.45,49.51 37.04,49.51 36.61,49.94 R15.2
N$18
  Top 0.254: 48.36,51.2 Q2.1
  Top 0.305: Q2.1 49.39,51.97 55.44,51.97 R13.1
N$19
  Top 0.305: C38.2 32.77,63.25 33.53,62.48 33.53,59.18 33.07,58.73 MAX3232.6
N$21
  Top 0.254: LED4.A 48.15,27.57
  Top 0.305: RN1.5 50.83,26.86 49.97,27.72 LED4.A
N$22  (via drill 0.35, 0.41)
  Top 0.305: MAX3232.2 32.41,61.32
  Top 0.406: 32.41,61.32 v32.51,61.21 | C37.2 29.3,55.37 32.26,55.37 v32.51,55.63
  Bottom 0.406: v32.51,61.21 v32.51,55.63
N$23
  Top 0.61: R18.2 13.21,19.3 14.48,18.03 17.78,18.03 18.16,18.41 U2.2
N$24
  Top 0.254: LED2.A 48.35,24.31
  Top 0.305: RN1.7 48.59,24.42 LED2.A
N$26
  Top 0.305: RN1.8 50.83,23.19 50.16,22.52 48.77,22.52 LED1.A
N$28
  Top 0.508: R1-C5.1 61.97,13.97 R2-C.2
  Top 0.813: C1-C.1 63.69,13.9 R2-C.2
N$32  (via drill 0.41)
  Top 0.305: R22.2 v32.51,30.1 | v35.81,30.1 35.81,28.57 36.32,28.07 37.08,28.07 37.47,28.45 37.47,29.18 U4.7 37.52,31.57 SJ4.2
  Bottom 0.305: v32.51,30.1 v35.81,30.1
N$33
  Top 0.305: U4.8 36.87,30.57 36.45,30.99 34.67,30.99 | 34.67,30.99 34.04,31.62 SJ3.2 | R23.2 34.42,30.73 34.67,30.99
PB0
  Top 0.254: U1.113 88.79,28.56 IO1.2
PB1
  Top 0.254: U1.114 89.51,29.06 IO1.3
PIN46  (via drill 0.41)
  Top 0.254: U1.99 77.4,22.96 v77.35,22.9
  Top 0.305: RG.2 62.48,6.35 62.99,6.35 63.54,6.9 63.54,7.27
  Top 0.406: v74.59,20.1 74.47,19.98 67.51,19.98 66.61,19.07 66.61,7.92 65.95,7.27
  Top 0.508: 65.95,7.27 63.54,7.27 C19.1
  Bottom 0.406: v74.59,20.1 77.35,22.61 v77.35,22.9
PIN48
  Top 0.254: U1.97 76.36,24.46 76.36,23 75.21,21.84 72.69,21.84 71.88,21.03 58.98,21.03 56.39,23.62 RN1.1 | RN1.1
PIN49
  Top 0.254: 56.47,24.42 59.4,21.49 71.69,21.49 72.55,22.35 75.07,22.35 75.9,23.18 U1.96
  Top 0.305: 56.47,24.42 RN1.2
PIN50
  Top 0.254: U1.95 75.4,23.33 74.93,22.86 72.41,22.86 71.5,21.95 59.84,21.95 56.57,25.22
  Top 0.305: 56.57,25.22 RN1.3
PIN51
  Top 0.254: U1.94 74.9,23.59 74.68,23.37 72.28,23.37 71.31,22.4 60.12,22.4 56.5,26.02
  Top 0.305: 56.5,26.02 RN1.4
RX_ARQ
  Top 0.305: MAX3232.14 38.05,60.66 38.86,61.47 38.86,63.25
  Top 0.406: ARQ_TERMINAL.2 47.24,64.77 46.84,65.18 40.79,65.18 38.86,63.25
RX_DUE  (via drill 0.35, 0.41)
  Top 0.254: U1.3 80.9,43.16 78,40.25 67.44,40.25 59.76,47.94 59.76,48.35 58.58,49.53 R9.2
  Top 0.305: v52.83,49.02 53.34,48.51 56.48,48.51 R9.2 | ARQ_TERMINAL.6 57.4,64.59 57.41,64.6 | 52.94,54.21 v52.83,54.1
  Top 0.406: R1.2 42.7,60.63 52.5,60.63 53.61,61.74 53.61,64.82 54.07,65.28 56.73,65.28 57.41,64.6 | ARQ_TERMINAL.6 57.4,60.58 54.83,58.01 53.57,58.01 52.94,57.38 52.94,54.21
  Bottom 0.305: v52.83,54.1 v52.83,49.02
RX_DUE1
  Top 0.305: MAX3232.12 39.95,59.36
  Top 0.406: 39.95,59.36 R1.1
RX_PROG
  Top 0.305: T8.3 67.98,51.25 R17.1
  Top 0.508: PROGRAMMER.3 76.92,62.15 75.63,60.87 71.57,60.87
  Top 0.61: T8.3 67.98,59.09 69.75,60.87 71.57,60.87
RX_SAM  (via drill 0.41)
  Top 0.254: U1.27 68.9,47.57 68.08,47.57 | 68.08,47.57 TP4.P$1 66.36,48.42 66.36,49.35 65.77,49.94 v65.79,52.58 | 68.08,47.57 68.2,47.69 R8.1
  Bottom 0.254: BT.4 84.58,55.63 68.83,55.63 v65.79,52.58
RXD0  (via drill 0.41)
  Top 0.254: 73.4,51.96 U1.18
  Top 0.305: v71.12,58.17 71.15,58.14 71.15,54.21 73.4,51.96
  Bottom 0.305: v71.12,58.17 66.04,63.31 SERIAL0.1
RXD1  (via drill 0.41)
  Top 0.254: v80.77,49.02 80.77,48.51 80.52,48.26 80.01,48.26 79.9,48.15 U1.5
  Bottom 0.254: SERIAL1.1 89.41,38.1 89.41,41.4 81.79,49.02 v80.77,49.02
SCL0-3
  Top 0.254: 40.64,28.7 40.26,28.32 39.12,28.32 38.82,28.62 U4.5 38.86,29.28 38.86,30.1 38.99,30.23 41.2,30.23 42.52,31.55 42.52,32.45 R3.1 | U1.87 71.4,23.4 70.87,22.86 60.55,22.86 56.52,26.89
  Top 0.305: 40.65,28.7 40.64,28.7 49.98,28.7 51.79,26.89 56.52,26.89
SCL1  (via drill 0.41)
  Top 0.254: U1.70 64.49,27.56 v65.28,26.92
  Top 0.406: RTC.3 46.23,38.1 45.47,37.34 45.47,32 46.74,30.73 50.29,30.73 51.96,29.07 v52.83,28.96
  Bottom 0.254: v52.83,28.96 54.86,26.92 v65.28,26.92
SDA0-3  (via drill 0.41)
  Top 0.254: U1.86 70.9,23.76 70.51,23.37 60.71,23.37 57,27.07 57,27.09 56.45,27.65 56.43,27.65
  Top 0.305: U4.6 38.17,30.94 39.08,31.79 | 39.08,31.79 R6.2 | 56.43,27.65 52.1,27.65 50.48,29.27 40.07,29.27 v39.88,29.21 | v39.88,30.99 39.08,31.78 39.08,31.79
  Bottom 0.254: v39.88,29.21 v39.88,30.99
SDA1  (via drill 0.41)
  Top 0.254: U1.9 77.9,43.12 78.12,42.91 v78.53,42.91
  Bottom 0.254: 65.07,30.91 arc45 64.89,30.99 | 61.98,30.99 59.51,33.45 arc-45 59.44,33.63 59.44,40.89
  Bottom 0.305: RTC.2 48.92,40.64 arc45 49.1,40.71 51.05,42.67 57.55,42.67 arc-45 57.73,42.6 59.44,40.89 | v78.53,42.91 78.64,42.79 78.64,42.32 77.72,41.4 77.72,28.64 77.34,28.26 77.34,26.42
  Bottom 0.406: 77.34,26.42 69.56,26.42 68.09,27.9 65.07,30.91 | 64.89,30.99 61.98,30.99
SPCK  (via drill 0.41)
  Top 0.254: 77.22,16.26 77.22,17.78 v78.15,18.71 78.49,19.05 85.1,19.05 86.23,20.18 | U1.110 84.7,27.06 85.86,25.9 85.86,21.58 86.23,21.21 86.23,20.18 | RN2.7 87.48,18.93 86.23,20.18
  Top 0.406: U$9.4 75.69,14.73 77.22,16.26
  Bottom 0.406: 78.23,18.8 v78.15,18.71
SS3  (via drill 0.41)
  Top 0.254: U1.142 83.19,43.06 80.77,40.64 v80.77,38.61 | v83.31,21.59 83.31,20.32 83.06,20.07 76.07,20.07 74.17,18.16 74.17,15.54 | RN2.5 89.08,19.63 v88.14,20.57
  Top 0.406: U$9.7 72.39,13.77 74.17,15.54
  Bottom 0.254: v88.14,20.57 87.12,21.59 v83.31,21.59 82.68,21.59 82.37,21.89
  Bottom 0.406: v80.77,38.61 80.63,38.43 80.63,23.64 82.37,21.89
SW
  Top 0.406: 20.7,33.15 D4.P$1
  pour Top (isolate 0.127, no thermals): 18.29,30.73 18.29,32.51 18.03,32.77 18.03,33.53 20.07,33.53 20.07,35.31 22.86,35.31 22.86,37.85 24.89,37.85 24.89,34.8 23.62,34.8 23.62,30.73
TX_ARQ
  Top 0.305: MAX3232.13 38.43,60.02 39.62,61.21
  Top 0.406: 39.62,61.21 39.62,62.48 40.89,63.75 ARQ_TERMINAL.1
TX_DUE
  Top 0.254: U1.4 80.4,43.43 77.76,40.79 67.67,40.79 60.22,48.24 60.22,48.54 57.52,51.24 R13.2
  Top 0.305: R13.2 57.52,52.08 57.03,52.56 53.07,52.56
  Top 0.406: ARQ_TERMINAL.5 54.86,60.2 53.39,58.73 50.73,58.73 49.4,57.39 | 49.4,57.39 49.4,56.24 53.07,52.56 | R2.2 48.88,57.91 49.4,57.39
TX_DUE1
  Top 0.305: MAX3232.11 39.31,58.73 R2.1
TX_PROG
  Top 0.305: T7.3 81.87,59.61 79.5,61.98 PROGRAMMER.2
  Top 0.406: R16.1 79.08,50.29 78.44,50.92 78.44,51.31 78.44,53.79 79.89,55.24 81.84,55.24 T7.3 | PROGRAMMER.2 79.52,63.75
TX_SAM
  Top 0.254: TP3.P$1 81.97,47.54 81.42,46.99 81.42,46.12 U1.2
  Top 0.305: 83.2,52.63 T7.2 83.25,52.58 BT.5
  Top 0.406: T7.2 81.97,52.16 TP3.P$1
TXD0  (via drill 0.41)
  Top 0.254: U1.17 73.9,52.43
  Top 0.305: 73.9,52.43 72.14,54.2 v72.14,56.64
  Bottom 0.305: v72.14,56.64 70.61,56.64 SERIAL0.2
TXD1  (via drill 0.41)
  Top 0.254: U1.6 79.4,48.69 v79.76,49.02
  Bottom 0.254: SERIAL1.2 88.9,36.07 88.9,41.15 81.79,48.26 80.01,48.26 79.76,48.51 v79.76,49.02
USBVCC  (via drill 0.41)
  Top 0.254: PROGRAMMER.4 74.42,64.77 74.38,64.81
  Top 0.406: T1.1 v22.29,46.35 | 74.38,64.81 73.15,66.04 38.61,66.04 37.85,65.28 25.15,65.28 23.59,63.72 v23.59,53.82
  Bottom 0.406: v23.59,53.82 22.59,52.81 22.59,46.69 22.27,46.37 v22.29,46.35
VBG
  Top 0.254: 61.58,42.56 60.71,43.43 60.71,45.47 | C25.1 60.71,45.47 | R7.2 59.18,47.5 60.71,45.97 60.71,45.47
  Top 0.279: U1.40 61.58,42.56
VDDANA
  Top 0.254: 63.76,25.15 U1.73
  Top 0.305: 63.76,25.15 60.71,25.15 58.99,26.86 C10.2 58.17,27.18 55.63,29.72 54.1,29.72 52.35,31.47 C3.+ | C3.+ 52.58,31.75 52.83,31.5 52.6,31.5 C3.+
  Top 0.406: C3.+ 51.22,31.75 L1.2
VDDOUT  (via drill 0.41)
  Top 0.254: v76.96,41.66 77.4,42.23 U1.10 77.4,49.28 | 60.19,32.06 U1.61 65.33,32.06 v66.55,33.27 | C14.2 60.12,34.56 U1.56 63.77,34.56 65.53,36.32 | C13.2 60.2,42.42 61.47,41.15 61.47,40.13 61.54,40.06 U1.45 65.86,40.06 | 77.4,49.97 77.4,49.28 | 77.4,49.97 77.4,50.11 | C17.2 76.64,50.04 77.4,49.28 | v76.96,32.26 80.01,32.26 81.81,34.06 U1.124 83.97,34.04 85.09,34.04 85.34,33.78 | L5.1 77.05,52.34 77.41,51.98 77.41,49.98 77.4,49.97 | 66.55,36.32 v66.55,35.05 | 85.34,33.78 87.12,32 C11.+ | C15.2 87.38,35.81 85.34,33.78
  Top 0.305: 60.19,32.06 C16.2 | C12.2 79.9,22.43 U1.104 79.9,26.02 v76.96,28.96
  Top 0.508: 65.86,40.06 66.55,39.37 66.55,36.32 | 65.53,36.32 66.55,36.32 | 66.55,36.32 76.71,36.32 v76.96,36.07
  Bottom 0.254: v66.55,33.27 v66.55,35.05
  Bottom 0.406: v76.96,28.96 v76.96,32.26 v76.96,36.07 v76.96,41.66
VDDOUTMI
  Top 0.254: U1.41 61.32,42.06 59.94,43.43 59.88,43.5 C9.2
  Top 0.305: 59.94,43.43 59.69,43.18 57.15,43.18 56.39,42.42 54.89,42.42 C2.+
  Top 0.406: 53.85,42.42 54.84,42.42 C2.+
  Top 0.813: L2.2 50.63,44.96 51.31,44.96 51.56,44.7 51.56,43.94 53.09,42.42 53.85,42.42
VDDPLL  (via drill 0.41)
  Top 0.254: C33.+ 74.45,53.49 L5.2 74.85,52.22 C32.2 | U1.34 65.4,44.52 67.25,42.67 v71.88,42.67
  Top 0.305: C32.2 75.44,51.56 74.81,50.93 74.81,47.43 v74.82,47.43
  Bottom 0.406: v71.88,42.67 71.88,44.49 v74.82,47.43
VIN
  Top 0.61: U2.3 16.89,20.19 17.78,21.08 23.62,21.08 24.38,21.84
  Top 1.27: F1.2 23.62,22.61 24.38,21.84 JP2.2
VIN_DUE
  Top 0.406: 24.46,25.78 PC1.+ 23.37,27.38 23.37,27.43 | IC2.5 20.51,29.97 R10.1 22.92,29.91 | 25.4,29.46 25.61,29.68 | 16.19,40.01 17.13,40.94 RN4.6
  Top 0.61: 24.83,25.92 PC1.+ | 15.48,27.41 15.49,27.43
  Top 1.016: 16.19,40.01 14.67,40.01 12.89,38.23 12.89,28.83 14.29,27.43 15.49,27.43 23.37,27.43 24.38,28.45 | 24.38,28.45 25.4,29.46 | 22.92,29.91 24.38,28.45 | 25.61,29.68 C41.+ | F1.1 15.48,23.26 D1.C 15.48,27.41
XIN
  Top 0.254: 58.97,52.84 58.97,51.43 61.66,48.73 63.15,48.73 64.4,47.48 U1.36 | U1.36
  Top 0.406: 57.66,54.86 57.09,54.29 C22.1 | 58.97,52.84 58.97,54.96 58.93,55
  Top 0.61: Y1.1 58.93,55 57.79,55 57.66,54.86
XIN32
  Top 0.254: U1.48 61.23,38.56 C24.1 59.74,40.54 59.43,40.85 55.99,40.85 55.51,40.37 Y2.P$2
XOUT
  Top 0.254: U1.35 64.9,49.12 63.42,50.6 63.42,52.13 63.1,52.45
  Top 0.305: C21.1 63.1,52.45 62.08,52.45 Y1.3 62.18,52.34
XOUT32
  Top 0.254: U1.49 60.21,38.06
  Top 0.305: Y2.P$1 52.41,38.45 53.19,37.67 59.82,37.67 60.21,38.06 60.21,38.28 C23.1

### Text on the board
tNames: GND | TX | RX | GND | RST | ERS / CMD | USB / VCC | RX / PRG | TX / PRG | TX / ARQ | RX / ARQ | SW / ARQ | GND | TX / DUE | RX / DUE | 12V | GND | ARQ POWER | TX | RED | RX | TX | BLK | RX | GND | * | SOLAR CHARGE CONTROLLER | 5V | BLK | YLW | RX | TX | GND | GND | PB1 | BATTERY | (+) | PB0 | GND | (+) | SOLAR POWER | GND | 12V COL | GND | CANH | CANL | COL SW | GND | CANH | CANL | 5V | SIG | GND | masterboard_b12 / 05042018 / DYNASLOPE